# Altium project SensorBoard.PrjPcb
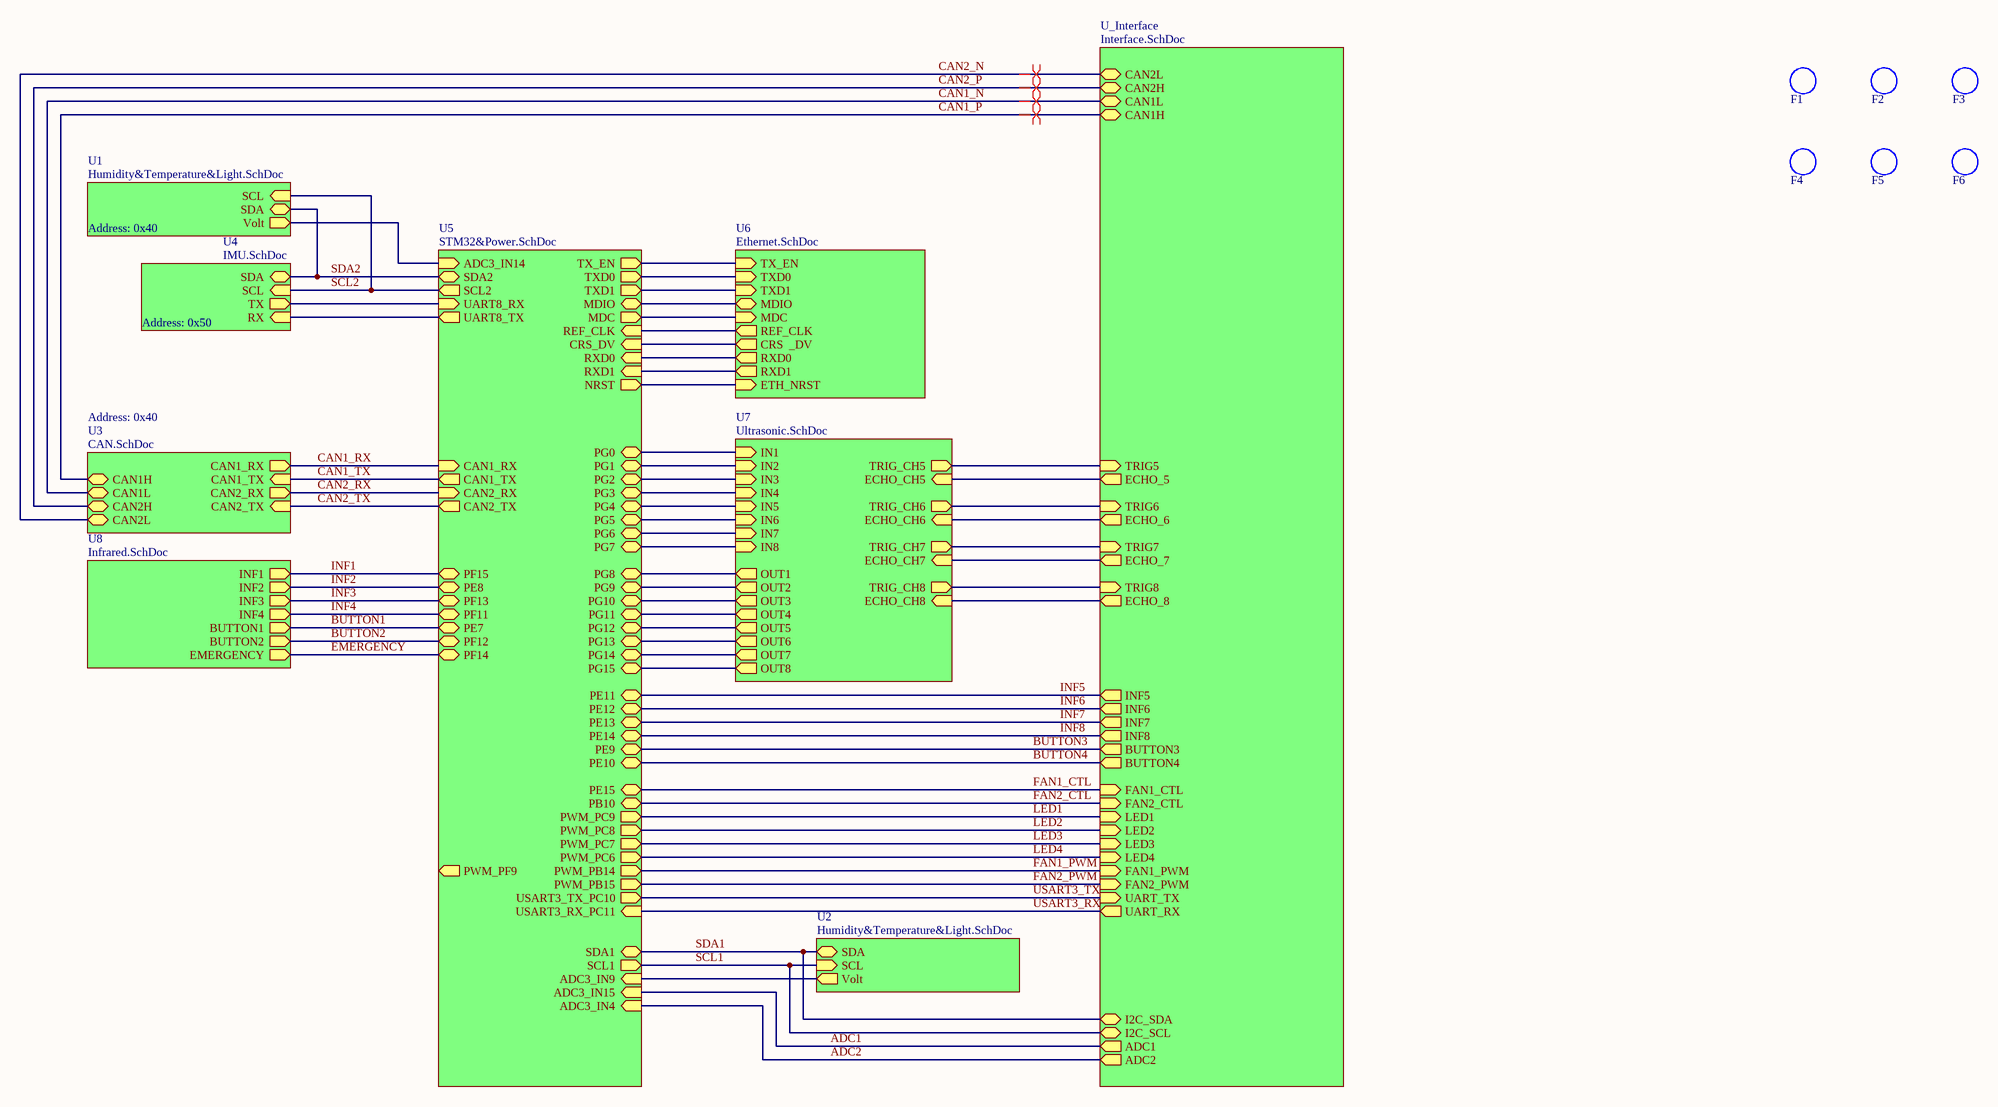
[diagram p0: SensorBoard.SchDoc]
9 sheets, 169 parts. Net scope: hierarchical (ports join the sheet entries above them; power ports are global).
Board file: Sensor.PcbDoc
Sheets:
  SensorBoard.SchDoc
    U6 = Ethernet.SchDoc
    U5 = STM32&Power.SchDoc
    U4 = IMU.SchDoc
    U1 = Humidity&Temperature&Light.SchDoc
    U2 = Humidity&Temperature&Light.SchDoc
    U3 = CAN.SchDoc
    U7 = Ultrasonic.SchDoc
    U8 = Infrared.SchDoc
    U_Interface = Interface.SchDoc

## Sheet SensorBoard.SchDoc
size A2

### Parts
F1  Fiducial, .040"  [FIDUCIAL, .040"]  (value not drawn)  (no BOM)
F2  Fiducial, .040"  [FIDUCIAL, .040"]  (value not drawn)  (no BOM)
F3  Fiducial, .040"  [FIDUCIAL, .040"]  (value not drawn)  (no BOM)
F4  Fiducial, .040"  [FIDUCIAL, .040"]  (value not drawn)  (no BOM)
F5  Fiducial, .040"  [FIDUCIAL, .040"]  (value not drawn)  (no BOM)
F6  Fiducial, .040"  [FIDUCIAL, .040"]  (value not drawn)  (no BOM)

### Sub-sheets
U1 = Humidity&Temperature&Light.SchDoc: SDA (bidir), SCL (in), Volt (out)
U2 = Humidity&Temperature&Light.SchDoc: SDA (bidir), SCL (in), Volt (out)
U3 = CAN.SchDoc: CAN1_TX (in), CAN1_RX (out), CAN2_TX (in), CAN2_RX (out), CAN1H (bidir), CAN2H (bidir), CAN1L (bidir), CAN2L (bidir)
U4 = IMU.SchDoc: RX (in), TX (out), SDA (bidir), SCL (in)
U5 = STM32&Power.SchDoc: SDA1 (bidir), SCL1 (out), MDC (out), REF_CLK (in), MDIO (bidir), CRS_DV (in), TX_EN (out), TXD0 (out), TXD1 (out), RXD0 (in), RXD1 (in), UART8_RX (in), UART8_TX (out), SDA2 (bidir), SCL2 (out), ADC3_IN14 (in), ADC3_IN15 (in), ADC3_IN9 (in), CAN2_TX (out), CAN2_RX (in), CAN1_TX (out), CAN1_RX (in), PG0 (bidir), PG1 (bidir), PG2 (bidir), PG3 (bidir), PG4 (bidir), PG5 (bidir), PG6 (bidir), PG7 (bidir), PG15 (bidir), PG10 (bidir), PG13 (bidir), PG9 (bidir), PG8 (bidir), PG12 (bidir), PG14 (bidir), PG11 (bidir), PF13 (bidir), PF12 (bidir), PF15 (bidir), PF14 (bidir), PF11 (bidir), PE14 (bidir), PE13 (bidir), PE10 (bidir), PE7 (bidir), PE15 (bidir), PE9 (bidir), PE12 (bidir), PE8 (bidir), PE11 (bidir), PB10 (bidir), PWM_PC6 (out), PWM_PF9 (out), PWM_PC9 (out), PWM_PC8 (out), PWM_PC7 (out), ADC3_IN4 (in), USART3_RX_PC11 (in), USART3_TX_PC10 (out), NRST (out), PWM_PB14 (out), PWM_PB15 (out)
U6 = Ethernet.SchDoc: TX_EN (in), RXD1 (out), TXD0 (in), TXD1 (in), RXD0 (out), CRS  _DV (out), MDIO (bidir), MDC (in), REF_CLK (out), ETH_NRST (in)
U7 = Ultrasonic.SchDoc: OUT1 (out), OUT2 (out), OUT3 (out), OUT4 (out), OUT5 (out), OUT6 (out), OUT7 (out), OUT8 (out), IN1 (in), IN2 (in), IN3 (in), IN4 (in), IN5 (in), IN6 (in), IN7 (in), IN8 (in), ECHO_CH5 (in), ECHO_CH6 (in), ECHO_CH7 (in), ECHO_CH8 (in), TRIG_CH5 (out), TRIG_CH6 (out), TRIG_CH7 (out), TRIG_CH8 (out)
U8 = Infrared.SchDoc: INF1 (out), INF2 (out), INF3 (out), INF4 (out), BUTTON1 (out), BUTTON2 (out), EMERGENCY (out)
U_Interface = Interface.SchDoc: CAN1H (bidir), CAN1L (bidir), CAN2H (bidir), CAN2L (bidir), ECHO_5 (out), ECHO_6 (out), ECHO_7 (out), ECHO_8 (out), TRIG5 (in), TRIG6 (in), TRIG7 (in), TRIG8 (in), BUTTON3 (out), BUTTON4 (out), INF5 (out), INF6 (out), INF7 (out), INF8 (out), I2C_SCL (bidir), I2C_SDA (bidir), LED1 (in), LED2 (in), LED3 (in), LED4 (in), ADC1 (out), ADC2 (out), UART_TX (in), UART_RX (out), FAN1_CTL (in), FAN2_CTL (in), FAN1_PWM (in), FAN2_PWM (in)

### Nets
ADC1: sheet U5/ADC3_IN15, sheet U_Interface/ADC1
ADC2: sheet U5/ADC3_IN4, sheet U_Interface/ADC2
BUTTON1: sheet U5/PE7, sheet U8/BUTTON1
BUTTON2: sheet U5/PF12, sheet U8/BUTTON2
BUTTON3: sheet U5/PE9, sheet U_Interface/BUTTON3
BUTTON4: sheet U5/PE10, sheet U_Interface/BUTTON4
CAN1_N: sheet U3/CAN1L, sheet U_Interface/CAN1L
CAN1_P: sheet U3/CAN1H, sheet U_Interface/CAN1H
CAN1_RX: sheet U5/CAN1_RX, sheet U3/CAN1_RX
CAN1_TX: sheet U5/CAN1_TX, sheet U3/CAN1_TX
CAN2_N: sheet U3/CAN2L, sheet U_Interface/CAN2L
CAN2_P: sheet U3/CAN2H, sheet U_Interface/CAN2H
CAN2_RX: sheet U5/CAN2_RX, sheet U3/CAN2_RX
CAN2_TX: sheet U5/CAN2_TX, sheet U3/CAN2_TX
CRS  _DV: sheet U6/CRS  _DV, sheet U5/CRS_DV
ECHO_CH5: sheet U7/ECHO_CH5, sheet U_Interface/ECHO_5
ECHO_CH6: sheet U7/ECHO_CH6, sheet U_Interface/ECHO_6
ECHO_CH7: sheet U7/ECHO_CH7, sheet U_Interface/ECHO_7
ECHO_CH8: sheet U7/ECHO_CH8, sheet U_Interface/ECHO_8
EMERGENCY: sheet U5/PF14, sheet U8/EMERGENCY
FAN1_CTL: sheet U5/PE15, sheet U_Interface/FAN1_CTL
FAN1_PWM: sheet U5/PWM_PB14, sheet U_Interface/FAN1_PWM
FAN2_CTL: sheet U5/PB10, sheet U_Interface/FAN2_CTL
FAN2_PWM: sheet U5/PWM_PB15, sheet U_Interface/FAN2_PWM
INF1: sheet U5/PF15, sheet U8/INF1
INF2: sheet U5/PE8, sheet U8/INF2
INF3: sheet U5/PF13, sheet U8/INF3
INF4: sheet U5/PF11, sheet U8/INF4
INF5: sheet U5/PE11, sheet U_Interface/INF5
INF6: sheet U5/PE12, sheet U_Interface/INF6
INF7: sheet U5/PE13, sheet U_Interface/INF7
INF8: sheet U5/PE14, sheet U_Interface/INF8
LED1: sheet U5/PWM_PC9, sheet U_Interface/LED1
LED2: sheet U5/PWM_PC8, sheet U_Interface/LED2
LED3: sheet U5/PWM_PC7, sheet U_Interface/LED3
LED4: sheet U5/PWM_PC6, sheet U_Interface/LED4
MDC: sheet U6/MDC, sheet U5/MDC
MDIO: sheet U6/MDIO, sheet U5/MDIO
NRST: sheet U6/ETH_NRST, sheet U5/NRST
PG0: sheet U5/PG0, sheet U7/IN1
PG1: sheet U5/PG1, sheet U7/IN2
PG2: sheet U5/PG2, sheet U7/IN3
PG3: sheet U5/PG3, sheet U7/IN4
PG4: sheet U5/PG4, sheet U7/IN5
PG5: sheet U5/PG5, sheet U7/IN6
PG6: sheet U5/PG6, sheet U7/IN7
PG7: sheet U5/PG7, sheet U7/IN8
PG8: sheet U5/PG8, sheet U7/OUT1
PG9: sheet U5/PG9, sheet U7/OUT2
PG10: sheet U5/PG10, sheet U7/OUT3
PG11: sheet U5/PG11, sheet U7/OUT4
PG12: sheet U5/PG12, sheet U7/OUT5
PG13: sheet U5/PG13, sheet U7/OUT6
PG14: sheet U5/PG14, sheet U7/OUT7
PG15: sheet U5/PG15, sheet U7/OUT8
REF_CLK: sheet U6/REF_CLK, sheet U5/REF_CLK
RXD0: sheet U6/RXD0, sheet U5/RXD0
RXD1: sheet U6/RXD1, sheet U5/RXD1
SCL1: sheet U5/SCL1, sheet U2/SCL, sheet U_Interface/I2C_SCL
SCL2: sheet U5/SCL2, sheet U4/SCL, sheet U1/SCL
SDA1: sheet U5/SDA1, sheet U2/SDA, sheet U_Interface/I2C_SDA
SDA2: sheet U5/SDA2, sheet U4/SDA, sheet U1/SDA
TRIG_CH5: sheet U7/TRIG_CH5, sheet U_Interface/TRIG5
TRIG_CH6: sheet U7/TRIG_CH6, sheet U_Interface/TRIG6
TRIG_CH7: sheet U7/TRIG_CH7, sheet U_Interface/TRIG7
TRIG_CH8: sheet U7/TRIG_CH8, sheet U_Interface/TRIG8
TX_EN: sheet U6/TX_EN, sheet U5/TX_EN
TXD0: sheet U6/TXD0, sheet U5/TXD0
TXD1: sheet U6/TXD1, sheet U5/TXD1
UART8_RX: sheet U5/UART8_RX, sheet U4/TX
UART8_TX: sheet U5/UART8_TX, sheet U4/RX
USART3_RX: sheet U5/USART3_RX_PC11, sheet U_Interface/UART_RX
USART3_TX: sheet U5/USART3_TX_PC10, sheet U_Interface/UART_TX
NetR19_U1_1: sheet U5/ADC3_IN14, sheet U1/Volt
NetR19_U2_1: sheet U5/ADC3_IN9, sheet U2/Volt

### Layout directives
differential pair: CAN1_N, CAN1_P, CAN2_N, CAN2_P

### Notes on the sheet
- Address: 0x40
- Address: 0x50

### Library data of the parts
F1-F6 = Fiducial, .040": Designator: F?; Part Number: Fiducial, .040"; Component Type: Standard (No BOM)

## Sheet Ethernet.SchDoc
size A2
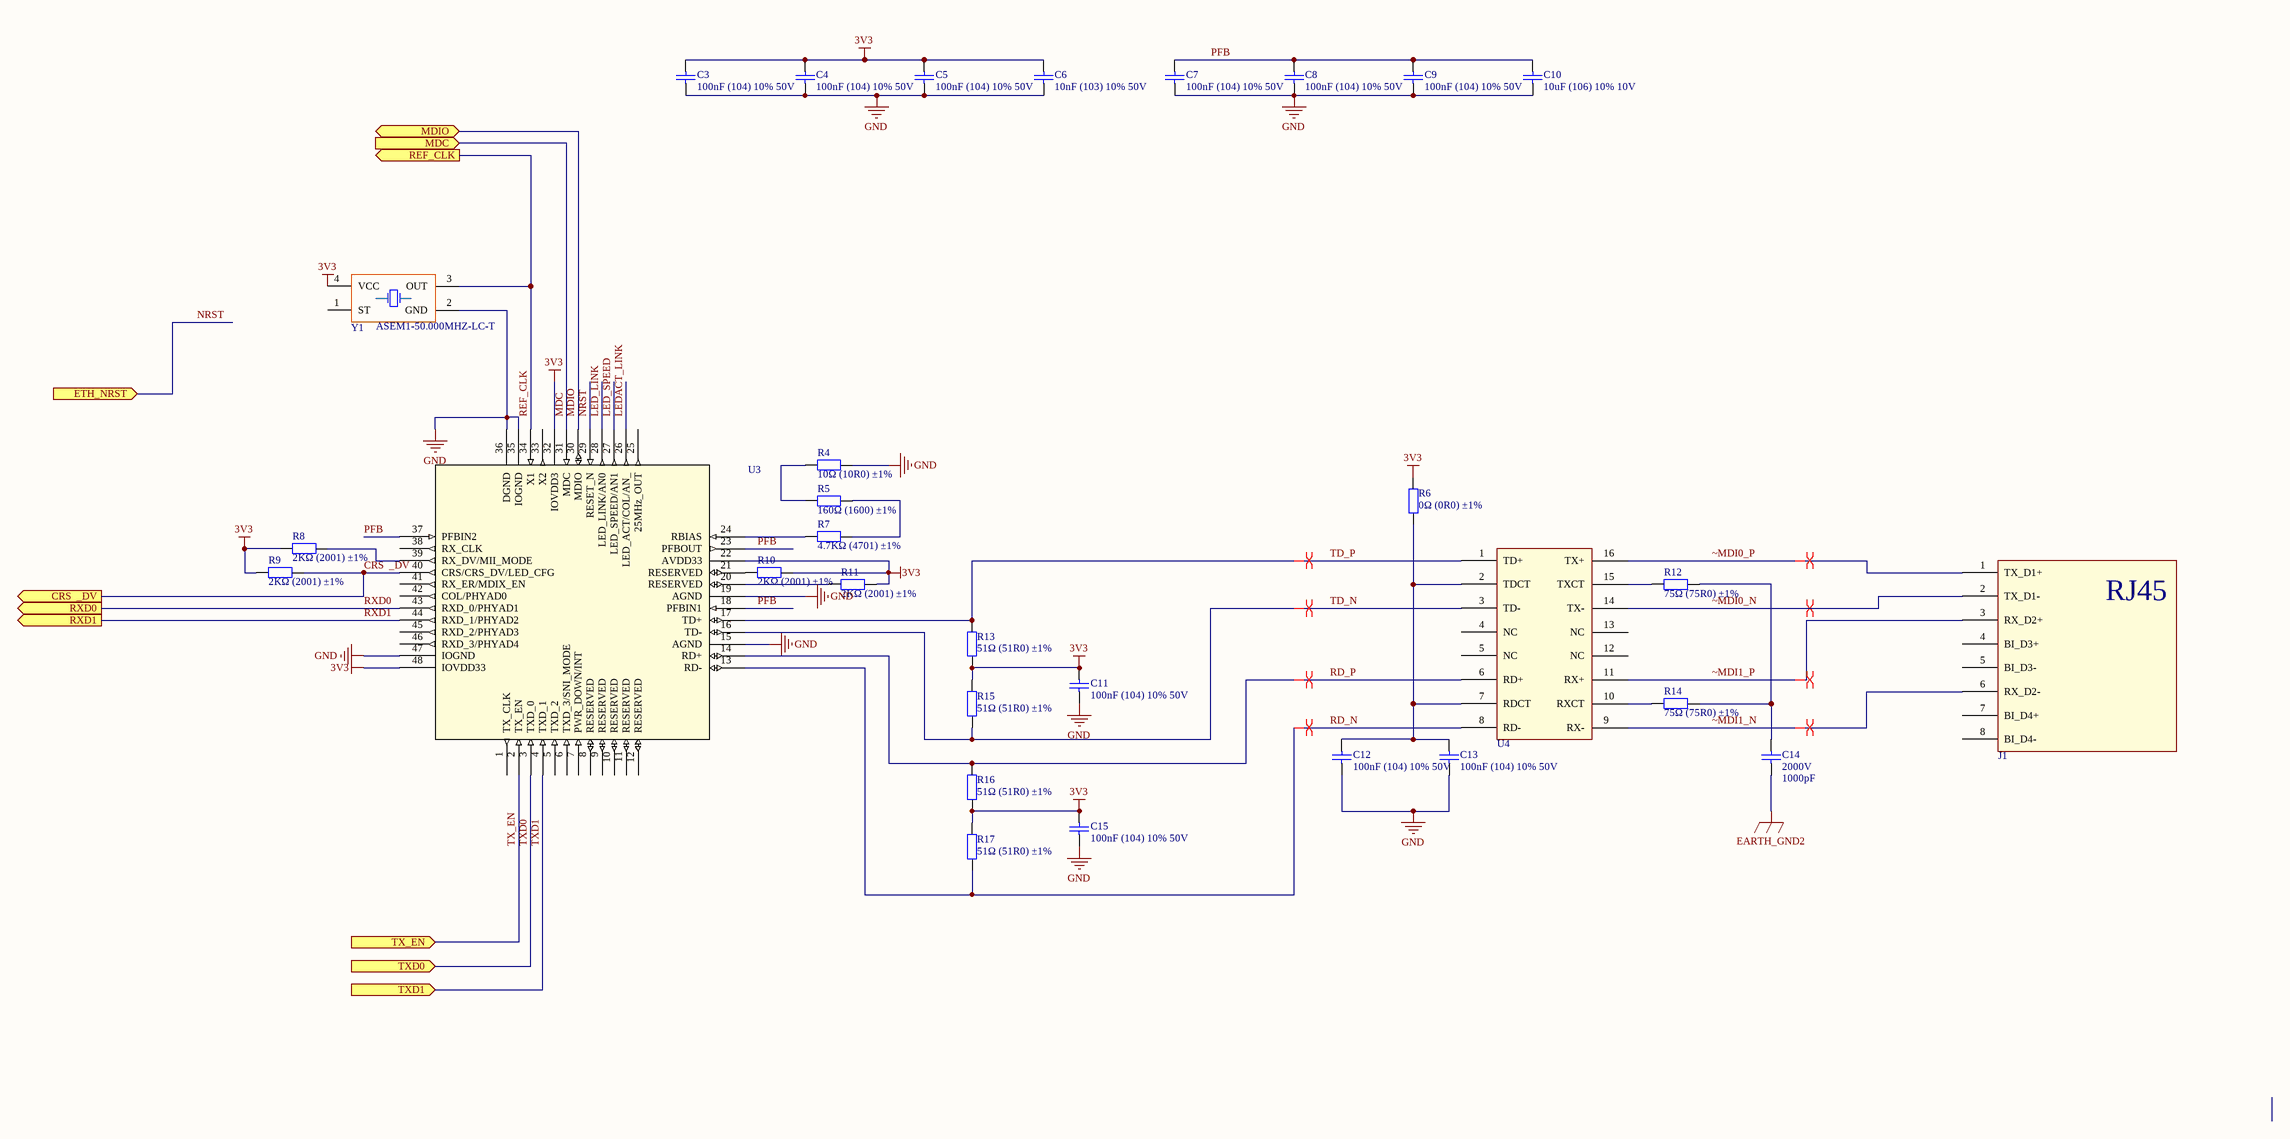
[diagram p1: Ethernet.SchDoc]

### Parts
C3  100nF (104) 10% 50V  [0603_C]
C4  100nF (104) 10% 50V  [0603_C]
C5  100nF (104) 10% 50V  [0603_C]
C6  10nF (103) 10% 50V  [0603_C]
C7  100nF (104) 10% 50V  [0603_C]
C8  100nF (104) 10% 50V  [0603_C]
C9  100nF (104) 10% 50V  [0603_C]
C10  10uF (106) 10% 10V  [0603_C]
C11  100nF (104) 10% 50V  [0603_C]
C12  100nF (104) 10% 50V  [0603_C]
C13  100nF (104) 10% 50V  [0603_C]
C14  2000V  value 1000pF  [CAP1210N]
C15  100nF (104) 10% 50V  [0603_C]
J1  Jack Modular Connector 8p8c (RJ45, Ethernet) Vertical Unshielded Cat3  [RJ45-5556416-1]  (value not drawn)
R4  10Ω (10R0) ±1%  [0603_R]
R5  160Ω (1600) ±1%  [0603_R]
R6  0Ω (0R0) ±1%  [0603_R]
R7  4.7KΩ (4701) ±1%  [0603_R]
R8  2KΩ (2001) ±1%  [0603_R]
R9  2KΩ (2001) ±1%  [0603_R]
R10  2KΩ (2001) ±1%  [0603_R]
R11  2KΩ (2001) ±1%  [0603_R]
R12  75Ω (75R0) ±1%  [0603_R]
R13  51Ω (51R0) ±1%  [0603_R]
R14  75Ω (75R0) ±1%  [0603_R]
R15  51Ω (51R0) ±1%  [0603_R]
R16  51Ω (51R0) ±1%  [0603_R]
R17  51Ω (51R0) ±1%  [0603_R]
U3  IC TXRX ETHERNET 48LQFP  [48-LQFP]  (value not drawn)
U4  TRANSFORMER  [Bel_transformer]  (value not drawn)
Y1  Part Number: ASEM1-50.000MHZ-LC-T  [SMD-3225]  (hidden comment: Oscillator)

### Ports
CRS  _DV (out), ETH_NRST (in), MDC (in), MDIO (bidir), REF_CLK (out), RXD0 (out), RXD1 (out), TX_EN (in), TXD0 (in), TXD1 (in)

### Nets
3V3: C3.2 C4.2 C5.2 C6.2 C11.2 C15.2 R6.2 R8.2 R9.2 R10.1 R11.1 R13.1 R15.2 R16.1 R17.2 U3.22(AVDD33) U3.32(IOVDD3) U3.48(IOVDD33) Y1.4(VCC)
EARTH_GND2: C14.1
GND: C3.1 C4.1 C5.1 C6.1 C7.1 C8.1 C9.1 C10.1 C11.1 C12.2 C13.1 C15.1 R4.2 U3.15(AGND) U3.19(AGND) U3.35(IOGND) U3.36(DGND) U3.47(IOGND) Y1.2(GND)
CRS  _DV: R9.1 U3.40(CRS/CRS_DV/LED_CFG) ; port CRS  _DV
LED_LINK: U3.28(LED_LINK/AN0)
LED_SPEED: U3.27(LED_SPEED/AN1)
LEDACT_LINK: U3.26(LED_ACT/COL/AN_)
MDC: U3.31(MDC) ; port MDC
MDIO: U3.30(MDIO) ; port MDIO
NRST: U3.29(RESET_N) ; port ETH_NRST
PFB: C7.2 C8.2 C9.2 C10.2 U3.18(PFBIN1) U3.23(PFBOUT) U3.37(PFBIN2)
RD_N: R17.1 U3.13(RD-) U4.8(RD-)
RD_P: R16.2 U3.14(RD+) U4.6(RD+)
REF_CLK: U3.34(X1) Y1.3(OUT) ; port REF_CLK
RXD0: U3.43(RXD_0/PHYAD1) ; port RXD0
RXD1: U3.44(RXD_1/PHYAD2) ; port RXD1
TD_N: R15.1 U3.16(TD-) U4.3(TD-)
TD_P: R13.2 U3.17(TD+) U4.1(TD+)
TX_EN: U3.2(TX_EN) ; port TX_EN
TXD0: U3.3(TXD_0) ; port TXD0
TXD1: U3.4(TXD_1) ; port TXD1
~MDI0_N: J1.2(TX_D1-) U4.14(TX-)
~MDI0_P: J1.1(TX_D1+) U4.16(TX+)
~MDI1_N: J1.6(RX_D2-) U4.9(RX-)
~MDI1_P: J1.3(RX_D2+) U4.11(RX+)
NetC12_1: C12.1 C13.2 R6.1 U4.2(TDCT) U4.7(RDCT)
NetC14_2: C14.2 R12.2 R14.2
NetR4_1: R4.1 R5.1
NetR5_2: R5.2 R7.2
NetR7_1: R7.1 U3.24(RBIAS)
NetR8_1: R8.1 U3.39(RX_DV/MII_MODE)
NetR10_2: R10.2 U3.21(RESERVED)
NetR11_2: R11.2 U3.20(RESERVED)
NetR12_1: R12.1 U4.15(TXCT)
NetR14_1: R14.1 U4.10(RXCT)

Not connected (* = marked no-connect by the designer): J1 4(BI_D3+) 5(BI_D3-) 7(BI_D4+) 8(BI_D4-); U3 1(TX_CLK) 5(TXD_2) 6(TXD_3/SNI_MODE) 7(PWR_DOWN/INT) 8(RESERVED) 9(RESERVED) 10(RESERVED) 11(RESERVED) 12(RESERVED) 25(25MHz_OUT) 33(X2) 38(RX_CLK) 41(RX_ER/MDIX_EN) 42(COL/PHYAD0) 45(RXD_2/PHYAD3) 46(RXD_3/PHYAD4); U4 4(NC) 5(NC) 12(NC) 13(NC); Y1 1(ST)

### Layout directives
differential pair: RD_N, RD_P, TD_N, TD_P, ~MDI0_N, ~MDI0_P, ~MDI1_N, ~MDI1_P

### Notes on the sheet
- (in symbol 5556416-1) RJ45

### Library data of the parts
C3-C5 C7-C9 C11-C13 C15 = 0603 100nF (104) 10% 50V: 贴片电容; ComponentLink1Description: 供应商链接; ComponentLink1URL: http://www.szlcsc.com/product/details_15331.html; Package: 0603; Supplier: LC; SuppliersPartNumber: C14663
C6 = 0603 10nF (103) 10% 50V: 贴片电容; ComponentLink1Description: 供应商链接; ComponentLink1URL: http://www.szlcsc.com/product/details_58143.html; Package: 0603; Supplier: LC; SuppliersPartNumber: C57112
C10 = 0603 10uF (106) 10% 10V: 贴片电容; ComponentLink1Description: 供应商链接; ComponentLink1URL: http://www.szlcsc.com/product/details_20411.html; Package: 0603; Supplier: LC; SuppliersPartNumber: C19702
C14 = CAP 1000pF ±10% 2000V (2kV) Ceramic Capacitor X7R 1210 (3225 Metric): Manufacturer: Samsung Electro-Mechanics; Manufacturer Part Number: CL32B102KJFNNNE; Unit Price in Quantity: 0.0884; Part Number: CAP 1000pF ±10% 2000V (2kV) Ceramic Capacitor X7R 1210 (3225 Metric); Component Type: Standard; Mounting Type: smt; Supplier 1: Digikey; Supplier 1 Part Number: 1276-3316-6-ND; Part URL-Supplier 1: https://www.digikey.com/product-detail/en/samsung-electro-mechanics/CL32B102KJFNNNE/1276-3316-6-ND/3893831; Unit Price-Supplier 1: 0.34; Price Break: 1000; Vendor/Distributor: Digikey; Package: 1210
J1 = 5556416-1: RJ45 connector 180 degrees; Manufacturer: TE; Unit Price in Quantity: .5722; Part Number: 5556416-1; Mounting Type: thru-hole; Package: Header; Component Type: Standard; Pin Count: 8; Manufacturer Part Number: 5556416-1; Supplier 1: Digikey; Supplier 1 Part Number: A31428-ND; Unit Price-Supplier 1: 1.04; Price Break: 1000; Vendor/Distributor: Digikey
R4 = 0603 10Ω (10R0) 1%: 贴片电阻; ComponentLink1Description: 供应商链接; ComponentLink1URL: http://www.szlcsc.com/product/details_23586.html; Package: 0603; Supplier: LC; SuppliersPartNumber: C22859
R5 = 0603 160Ω (1600) 1%: 贴片电阻; ComponentLink1Description: 供应商链接; ComponentLink1URL: http://www.szlcsc.com/product/details_23541.html; Package: 0603; Supplier: LC; SuppliersPartNumber: C22814
R6 = 0603 0Ω (0R0) 1%: 贴片电阻; ComponentLink1Description: 供应商链接; ComponentLink1URL: http://www.szlcsc.com/product/details_21903.html; Package: 0603; Supplier: LC; SuppliersPartNumber: C21189
R7 = 0603 4.7KΩ (4701) 1%: 贴片电阻; ComponentLink1Description: 供应商链接; ComponentLink1URL: http://www.szlcsc.com/product/details_23889.html; Package: 0603; Supplier: LC; SuppliersPartNumber: C23162
R8-R11 = 0603 2KΩ (2001) 1%: 贴片电阻; ComponentLink1Description: 供应商链接; ComponentLink1URL: http://www.szlcsc.com/product/details_23702.html; Package: 0603; Supplier: LC; SuppliersPartNumber: C22975
R12 R14 = 0603 75Ω (75R0) 1%: 贴片电阻; ComponentLink1Description: 供应商链接; ComponentLink1URL: http://www.szlcsc.com/product/details_4682.html; Package: 0603; Supplier: LC; SuppliersPartNumber: C4275
R13 R15-R17 = 0603 51Ω (51R0) 1%: 贴片电阻; ComponentLink1Description: 供应商链接; ComponentLink1URL: http://www.szlcsc.com/product/details_23924.html; Package: 0603; Supplier: LC; SuppliersPartNumber: C23197
U3 = DP83848CVVX/NOPB: Manufacturer: Texas Instruments; Unit Price in Quantity: 3.2349; Part Number: DP83848CVVX/NOPB; Component Type: Standard; Pin Count: 48; Manufacturer Part Number: DP83848CVVX/NOPB; Mounting Type: fine pitch; Package: 48-LQFP; Supplier 1: Digikey; Supplier 1 Part Number: DP83848CVVX/NOPBCT-ND; Unit Price-Supplier 1: 5.16; Price Break: 500
U4 = MODULE XFRMR LAN 10/100B-TX SMD: Manufacturer: Bel Fuse Inc.; Manufacturer Part Number: S558-5999-U7-F; Unit Price in Quantity: 1.9439; Part Number: MODULE XFRMR LAN 10/100B-TX SMD; Mounting Type: smt; Package: Non-standard; Component Type: Standard; DatasheetDocument: https://www.belfuse.com/resources/ICMs/lan-/S558-5999-U7-F.pdf; Supplier 1: Digikey; Supplier 1 Part Number: 507-1463-1-ND; Part URL-Supplier 1: https://www.digikey.sg/product-detail/zh/bel-fuse-inc/S558-5999-U7-F/507-1463-1-ND/2108047; Unit Price-Supplier 1: 3.6; Price Break: 900; Vendor/Distributor: Digikey
Y1 = ASEM1-50.000MHZ-LC-T: OSC MEMS 50.000MHZ CMOS SMD; Manufacturer: Abracon LLC; Unit Price in Quantity: .8712; Mounting Type: smt; Package: SMD3225; Component Type: Standard; Manufacturer Part Number: ASEM1-50.000MHZ-LC-T; Supplier 1: Digikey; Supplier 1 Part Number: 535-9774-1-ND; Unit Price-Supplier 1: 1.26; Price Break: 500; Vendor/Distributor: Digikey

## Sheet STM32&Power.SchDoc
size A2
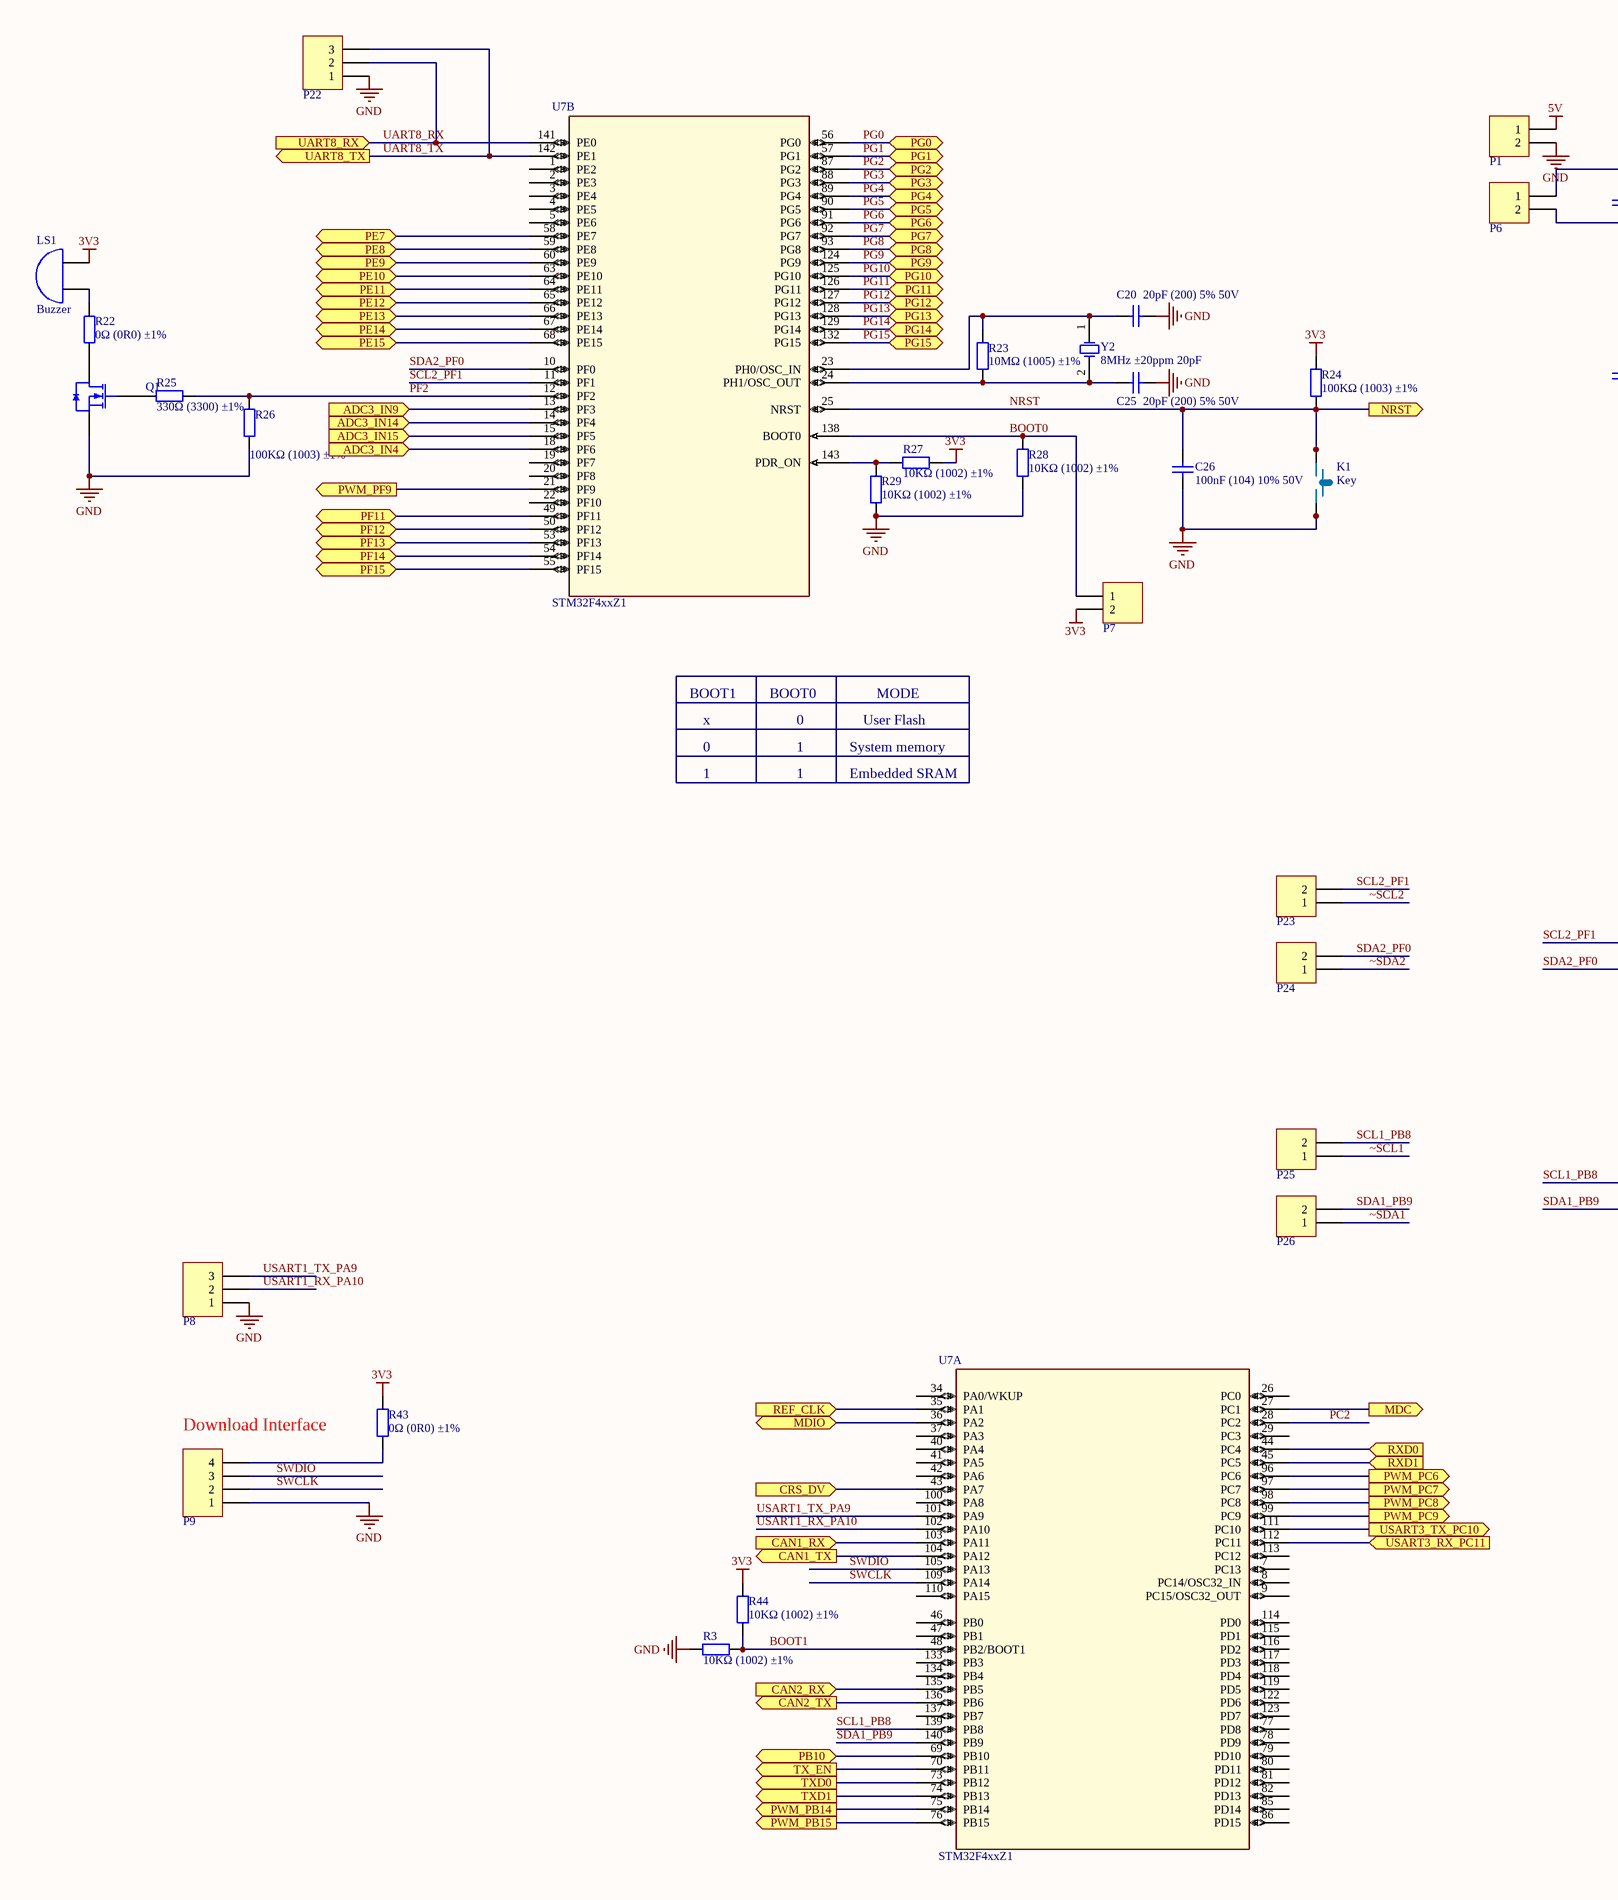
[diagram p2: STM32&Power.SchDoc, left]
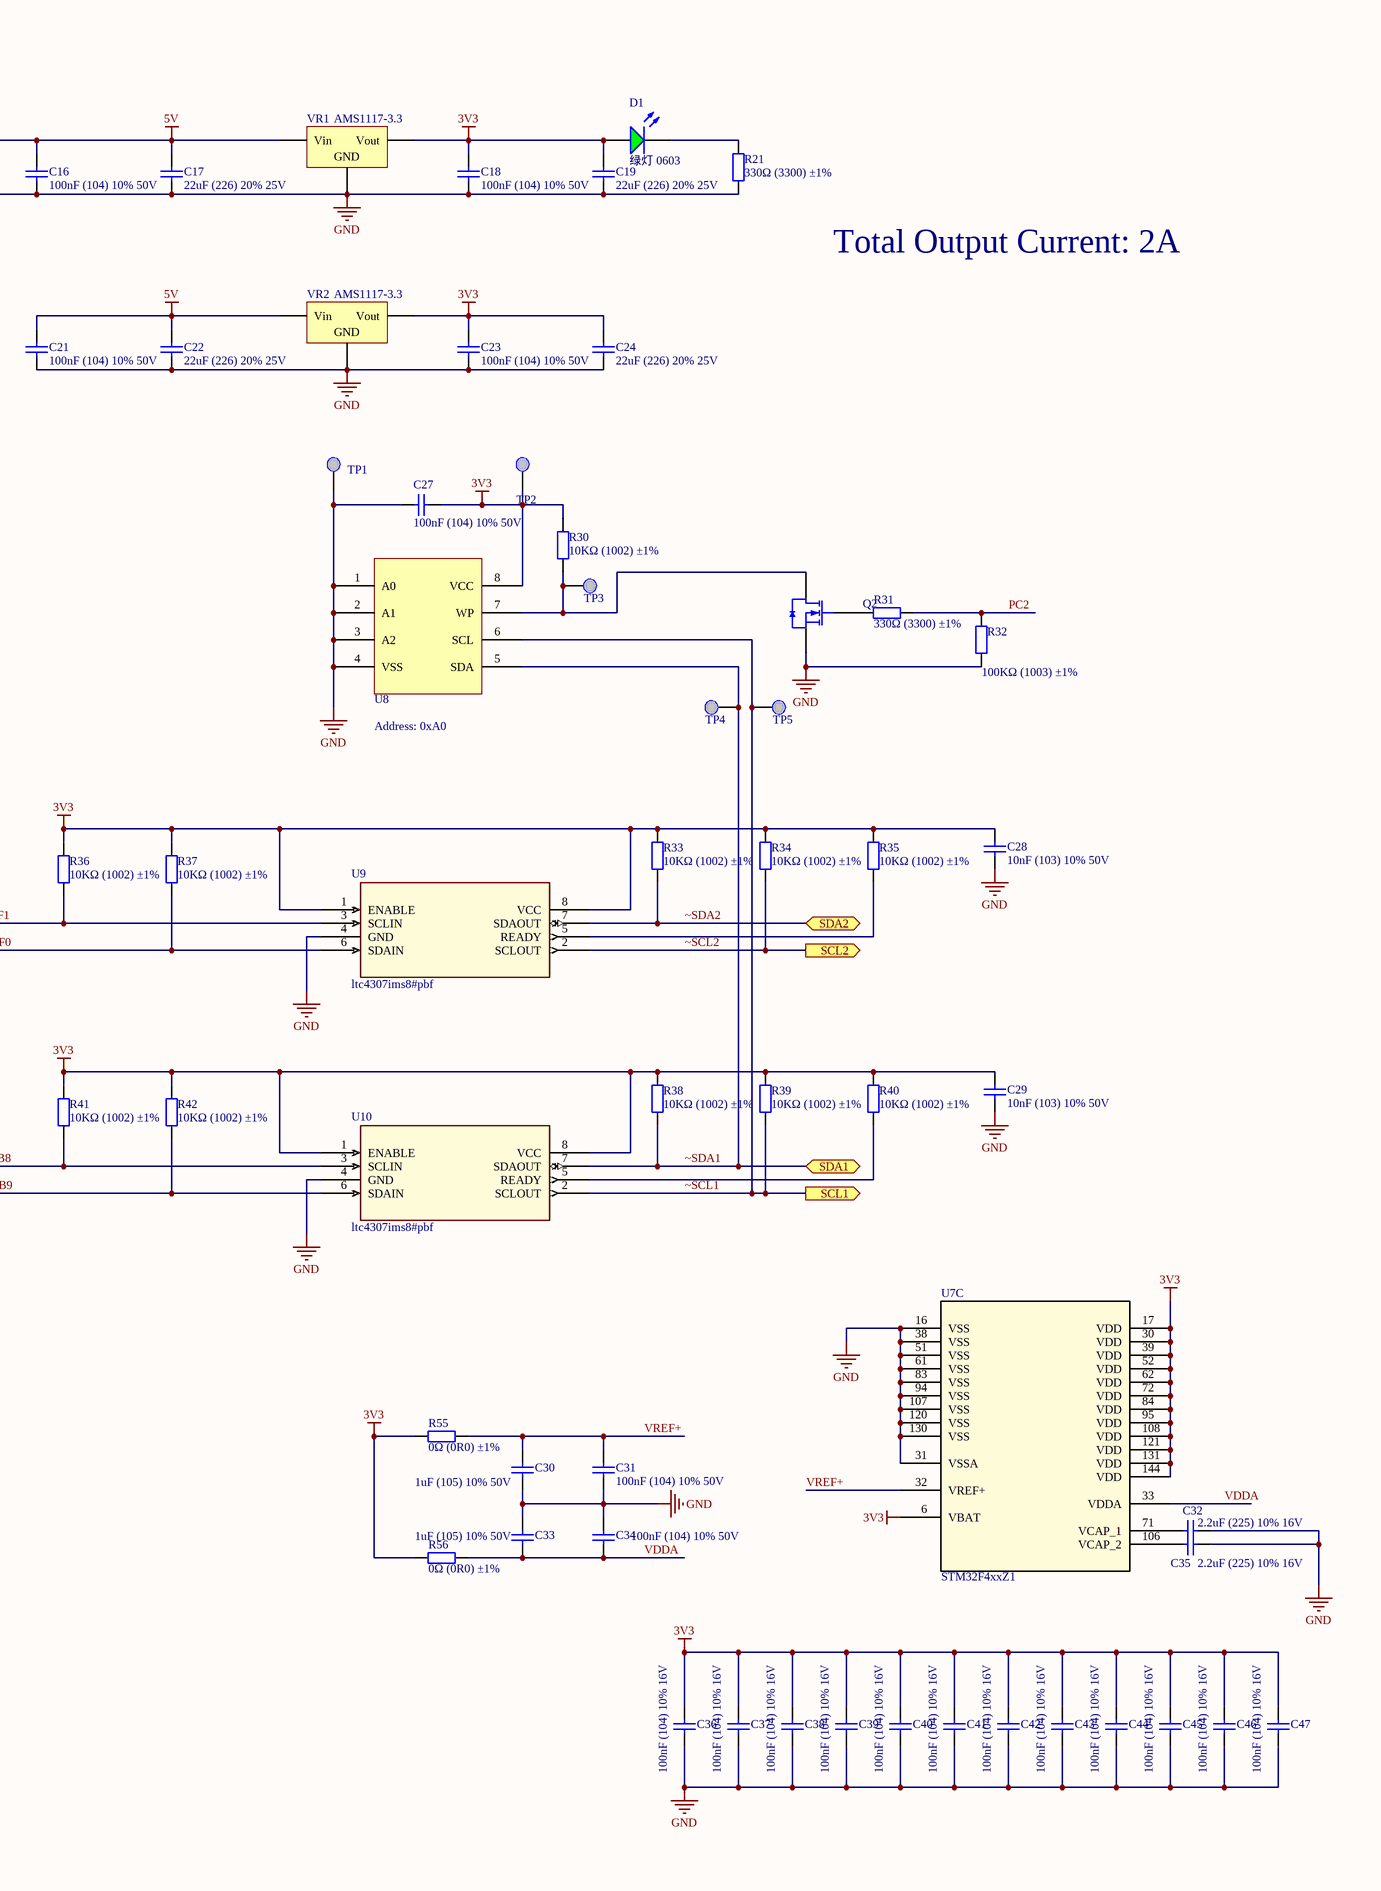
[diagram p3: STM32&Power.SchDoc, right]

### Parts
C16  100nF (104) 10% 50V  [0603_C]
C17  22uF (226) 20% 25V  [0805_C]
C18  100nF (104) 10% 50V  [0603_C]
C19  22uF (226) 20% 25V  [0805_C]
C20  20pF (200) 5% 50V  [0603_C]
C21  100nF (104) 10% 50V  [0603_C]
C22  22uF (226) 20% 25V  [0805_C]
C23  100nF (104) 10% 50V  [0603_C]
C24  22uF (226) 20% 25V  [0805_C]
C25  20pF (200) 5% 50V  [0603_C]
C26  100nF (104) 10% 50V  [0603_C]
C27  100nF (104) 10% 50V  [0603_C]
C28  10nF (103) 10% 50V  [0603_C]
C29  10nF (103) 10% 50V  [0603_C]
C30  1uF (105) 10% 50V  [0603_C]
C31  100nF (104) 10% 50V  [0603_C]
C32  2.2uF (225) 10% 16V  [0603_C]
C33  1uF (105) 10% 50V  [0603_C]
C34  100nF (104) 10% 50V  [0603_C]
C35  2.2uF (225) 10% 16V  [0603_C]
C36  100nF (104) 10% 16V  [0402_C]
C37  100nF (104) 10% 16V  [0402_C]
C38  100nF (104) 10% 16V  [0402_C]
C39  100nF (104) 10% 16V  [0402_C]
C40  100nF (104) 10% 16V  [0402_C]
C41  100nF (104) 10% 16V  [0402_C]
C42  100nF (104) 10% 16V  [0402_C]
C43  100nF (104) 10% 16V  [0402_C]
C44  100nF (104) 10% 16V  [0402_C]
C45  100nF (104) 10% 16V  [0402_C]
C46  100nF (104) 10% 16V  [0402_C]
C47  100nF (104) 10% 16V  [0402_C]
D1  绿灯 0603  [0603_LED_S1]
K1  Key  [Key]
LS1  Buzzer  [buzzer]
P1  0.1" 2POS Header SNGL  [2 POS HEADER SINGLE ROW]  (value not drawn)
P6  B2B-PH-SM4-TB(LF)(SN)  [B2B-PH-SM4-TB(LF)(SN)]  (value not drawn)
P7  0.1" 2POS Header SNGL  [2 POS HEADER SINGLE ROW]  (value not drawn)
P8  0.1" 3POS Header SNGL  [3 POS HEADER SINGLE ROW]  (value not drawn)
P9  0.1" 4POS Header SNGL  [4 POS HEADER SINGLE ROW]  (value not drawn)
P22  0.1" 3POS Header SNGL  [3 POS HEADER SINGLE ROW]  (value not drawn)
P23  0.1" 2POS Header SNGL  [2 POS HEADER SINGLE ROW]  (value not drawn)
P24  0.1" 2POS Header SNGL  [2 POS HEADER SINGLE ROW]  (value not drawn)
P25  0.1" 2POS Header SNGL  [2 POS HEADER SINGLE ROW]  (value not drawn)
P26  0.1" 2POS Header SNGL  [2 POS HEADER SINGLE ROW]  (value not drawn)
Q1  AO3400A N道沟 X0YV1T SOT-23  [SOT-23-3L]  (value not drawn)
Q2  AO3400A N道沟 X0YV1T SOT-23  [SOT-23-3L]  (value not drawn)
R3  10KΩ (1002) ±1%  [0603_R]
R21  330Ω (3300) ±1%  [0603_R]
R22  0Ω (0R0) ±1%  [0603_R]
R23  10MΩ (1005) ±1%  [0603_R]
R24  100KΩ (1003) ±1%  [0603_R]
R25  330Ω (3300) ±1%  [0603_R]
R26  100KΩ (1003) ±1%  [0603_R]
R27  10KΩ (1002) ±1%  [0603_R]
R28  10KΩ (1002) ±1%  [0603_R]
R29  10KΩ (1002) ±1%  [0603_R]
R30  10KΩ (1002) ±1%  [0603_R]
R31  330Ω (3300) ±1%  [0603_R]
R32  100KΩ (1003) ±1%  [0603_R]
R33  10KΩ (1002) ±1%  [0603_R]
R34  10KΩ (1002) ±1%  [0603_R]
R35  10KΩ (1002) ±1%  [0603_R]
R36  10KΩ (1002) ±1%  [0603_R]
R37  10KΩ (1002) ±1%  [0603_R]
R38  10KΩ (1002) ±1%  [0603_R]
R39  10KΩ (1002) ±1%  [0603_R]
R40  10KΩ (1002) ±1%  [0603_R]
R41  10KΩ (1002) ±1%  [0603_R]
R42  10KΩ (1002) ±1%  [0603_R]
R43  0Ω (0R0) ±1%  [0603_R]
R44  10KΩ (1002) ±1%  [0603_R]
R55  0Ω (0R0) ±1%  [0603_R]
R56  0Ω (0R0) ±1%  [0603_R]
TP1  Test Point, 60mil  [test_point_60_mil]  (value not drawn)
TP2  Test Point, 60mil  [test_point_60_mil]  (value not drawn)
TP3  Test Point, 60mil  [test_point_60_mil]  (value not drawn)
TP4  Test Point, 60mil  [test_point_60_mil]  (value not drawn)
TP5  Test Point, 60mil  [test_point_60_mil]  (value not drawn)
U7  STM32F4xxZ1  [LQFP-144_20x20x05P]  (parts A,B,C of 3)
U8  M24C02-WMN6TP  [SOIC127P600-8CM]  (value not drawn)
U9  ltc4307ims8#pbf  [MSOP-8_MS]
U10  ltc4307ims8#pbf  [MSOP-8_MS]
VR1  AMS1117-3.3  [SOT-223]
VR2  AMS1117-3.3  [SOT-223]
Y2  8MHz ±20ppm 20pF  [SMD-5032_2P]

### Ports
ADC3_IN4 (in), ADC3_IN9 (in), ADC3_IN14 (in), ADC3_IN15 (in), CAN1_RX (in), CAN1_TX (out), CAN2_RX (in), CAN2_TX (out), CRS_DV (in), MDC (out), MDIO (bidir), NRST (out), PB10 (bidir), PE7 (bidir), PE8 (bidir), PE9 (bidir), PE10 (bidir), PE11 (bidir), PE12 (bidir), PE13 (bidir), PE14 (bidir), PE15 (bidir), PF11 (bidir), PF12 (bidir), PF13 (bidir), PF14 (bidir), PF15 (bidir), PG0 (bidir), PG1 (bidir), PG2 (bidir), PG3 (bidir), PG4 (bidir), PG5 (bidir), PG6 (bidir), PG7 (bidir), PG8 (bidir), PG9 (bidir), PG10 (bidir), PG11 (bidir), PG12 (bidir), PG13 (bidir), PG14 (bidir), PG15 (bidir), PWM_PB14 (out), PWM_PB15 (out), PWM_PC6 (out), PWM_PC7 (out), PWM_PC8 (out), PWM_PC9 (out), PWM_PF9 (out), REF_CLK (in), RXD0 (in), RXD1 (in), SCL1 (out), SCL2 (out), SDA1 (bidir), SDA2 (bidir), TX_EN (out), TXD0 (out), TXD1 (out), UART8_RX (in), UART8_TX (out), USART3_RX_PC11 (in), USART3_TX_PC10 (out)

### Nets
3V3: C18.2 C19.2 C23.2 C24.2 C27.1 C28.2 C29.2 C36.2 C37.2 C38.2 C39.2 C40.2 C41.2 C42.2 C43.2 C44.2 C45.2 C46.2 C47.2 D1.A LS1.1(A) P7.2 R24.2 R27.2 R30.2 R33.2 R34.2 R35.2 R36.2 R37.2 R38.2 R39.2 R40.2 R41.2 R42.2 R43.2 R44.2 R55.1 R56.1 TP2.0 U7.6(VBAT) U7.17(VDD) U7.30(VDD) U7.39(VDD) U7.52(VDD) U7.62(VDD) U7.72(VDD) U7.84(VDD) U7.95(VDD) U7.108(VDD) U7.121(VDD) U7.131(VDD) U7.144(VDD) U8.8(VCC) U9.1(ENABLE) U9.8(VCC) U10.1(ENABLE) U10.8(VCC) VR1.2(Vout) VR2.2(Vout)
5V: C16.2 C17.2 C21.2 C22.2 P1.1 P6.1 VR1.3(Vin) VR2.3(Vin)
GND: C16.1 C17.1 C18.1 C19.1 C20.2 C21.1 C22.1 C23.1 C24.1 C25.2 C26.1 C27.2 C28.1 C29.1 C30.2 C31.1 C32.2 C33.1 C34.2 C35.2 C36.1 C37.1 C38.1 C39.1 C40.1 C41.1 C42.1 C43.1 C44.1 C45.1 C46.1 C47.1 K1.3 K1.4 P1.2 P6.2 P8.1 P9.1 P22.1 Q1.2(S) Q2.2(S) R3.2 R21.1 R26.1 R28.1 R29.1 R32.1 TP1.0 U7.16(VSS) U7.31(VSSA) U7.38(VSS) U7.51(VSS) U7.61(VSS) U7.83(VSS) U7.94(VSS) U7.107(VSS) U7.120(VSS) U7.130(VSS) U8.1(A0) U8.2(A1) U8.3(A2) U8.4(VSS) U9.4(GND) U10.4(GND) VR1.1(GND) VR2.1(GND)
ADC1: U7.15(PF5) ; port ADC3_IN15
ADC2: U7.18(PF6) ; port ADC3_IN4
BOOT0: P7.1 R28.2 U7.138(BOOT0)
BOOT1: R3.1 R44.1 U7.48(PB2/BOOT1)
BUTTON1: U7.58(PE7) ; port PE7
BUTTON2: U7.50(PF12) ; port PF12
BUTTON3: U7.60(PE9) ; port PE9
BUTTON4: U7.63(PE10) ; port PE10
CAN1_RX: U7.103(PA11) ; port CAN1_RX
CAN1_TX: U7.104(PA12) ; port CAN1_TX
CAN2_RX: U7.135(PB5) ; port CAN2_RX
CAN2_TX: U7.136(PB6) ; port CAN2_TX
CRS  _DV: U7.43(PA7) ; port CRS_DV
EMERGENCY: U7.54(PF14) ; port PF14
FAN1_CTL: U7.68(PE15) ; port PE15
FAN1_PWM: U7.75(PB14) ; port PWM_PB14
FAN2_CTL: U7.69(PB10) ; port PB10
FAN2_PWM: U7.76(PB15) ; port PWM_PB15
INF1: U7.55(PF15) ; port PF15
INF2: U7.59(PE8) ; port PE8
INF3: U7.53(PF13) ; port PF13
INF4: U7.49(PF11) ; port PF11
INF5: U7.64(PE11) ; port PE11
INF6: U7.65(PE12) ; port PE12
INF7: U7.66(PE13) ; port PE13
INF8: U7.67(PE14) ; port PE14
LED1: U7.99(PC9) ; port PWM_PC9
LED2: U7.98(PC8) ; port PWM_PC8
LED3: U7.97(PC7) ; port PWM_PC7
LED4: U7.96(PC6) ; port PWM_PC6
MDC: U7.27(PC1) ; port MDC
MDIO: U7.36(PA2) ; port MDIO
NRST: C26.2 K1.1 K1.2 R24.1 U7.25(NRST) ; port NRST
PC2: R31.2 R32.2 U7.28(PC2)
PF2: R25.2 R26.2 U7.12(PF2)
PG0: U7.56(PG0) ; port PG0
PG1: U7.57(PG1) ; port PG1
PG2: U7.87(PG2) ; port PG2
PG3: U7.88(PG3) ; port PG3
PG4: U7.89(PG4) ; port PG4
PG5: U7.90(PG5) ; port PG5
PG6: U7.91(PG6) ; port PG6
PG7: U7.92(PG7) ; port PG7
PG8: U7.93(PG8) ; port PG8
PG9: U7.124(PG9) ; port PG9
PG10: U7.125(PG10) ; port PG10
PG11: U7.126(PG11) ; port PG11
PG12: U7.127(PG12) ; port PG12
PG13: U7.128(PG13) ; port PG13
PG14: U7.129(PG14) ; port PG14
PG15: U7.132(PG15) ; port PG15
REF_CLK: U7.35(PA1) ; port REF_CLK
RXD0: U7.44(PC4) ; port RXD0
RXD1: U7.45(PC5) ; port RXD1
SCL1_PB8: P25.2 R41.1 U7.139(PB8) U10.3(SCLIN)
SCL2_PF1: P23.2 R36.1 U7.11(PF1) U9.3(SCLIN)
SDA1_PB9: P26.2 R42.1 U7.140(PB9) U10.6(SDAIN)
SDA2_PF0: P24.2 R37.1 U7.10(PF0) U9.6(SDAIN)
SWCLK: P9.2 U7.109(PA14)
SWDIO: P9.3 U7.105(PA13)
TX_EN: U7.70(PB11) ; port TX_EN
TXD0: U7.73(PB12) ; port TXD0
TXD1: U7.74(PB13) ; port TXD1
UART8_RX: P22.2 U7.141(PE0) ; port UART8_RX
UART8_TX: P22.3 U7.142(PE1) ; port UART8_TX
USART1_RX_PA10: P8.2 U7.102(PA10)
USART1_TX_PA9: P8.3 U7.101(PA9)
USART3_RX: U7.112(PC11) ; port USART3_RX_PC11
USART3_TX: U7.111(PC10) ; port USART3_TX_PC10
VDDA: C33.2 C34.1 R56.2 U7.33(VDDA)
VREF+: C30.1 C31.2 R55.2 U7.32(VREF+)
~SCL1: P25.1 R39.1 TP5.0 U8.6(SCL) U10.2(SCLOUT) ; port SCL1  [project net SCL1]
~SCL2: P23.1 R34.1 U9.2(SCLOUT) ; port SCL2  [project net SCL2]
~SDA1: P26.1 R38.1 TP4.0 U8.5(SDA) U10.7(SDAOUT) ; port SDA1  [project net SDA1]
~SDA2: P24.1 R33.1 U9.7(SDAOUT) ; port SDA2  [project net SDA2]
NetC20_1: C20.1 R23.2 U7.23(PH0/OSC_IN) Y2.1(OSC1)
NetC25_1: C25.1 R23.1 U7.24(PH1/OSC_OUT) Y2.2(OSC2)
NetC32_1: C32.1 U7.71(VCAP_1)
NetC35_1: C35.1 U7.106(VCAP_2)
NetD1_K: D1.K R21.2
NetLS1_2: LS1.2(B) R22.2
NetP9_4: P9.4 R43.1
NetQ1_1: Q1.1(G) R25.1
NetQ1_3: Q1.3(D) R22.1
NetQ2_1: Q2.1(G) R31.1
NetQ2_3: Q2.3(D) R30.1 TP3.0 U8.7(WP)
NetR19_U1_1: U7.14(PF4) ; port ADC3_IN14
NetR19_U2_1: U7.13(PF3) ; port ADC3_IN9
NetR27_1: R27.1 R29.2 U7.143(PDR_ON)
NetR35_1: R35.1 U9.5(READY)
NetR40_1: R40.1 U10.5(READY)
NetU7_21: U7.21(PF9) ; port PWM_PF9

Not connected (* = marked no-connect by the designer): U7 1(PE2) 2(PE3) 3(PE4) 4(PE5) 5(PE6) 7(PC13) 8(PC14/OSC32_IN) 9(PC15/OSC32_OUT) 19(PF7) 20(PF8) 22(PF10) 26(PC0) 29(PC3) 34(PA0/WKUP) 37(PA3) 40(PA4) 41(PA5) 42(PA6) 46(PB0) 47(PB1) 77(PD8) 78(PD9) 79(PD10) 80(PD11) 81(PD12) 82(PD13) 85(PD14) 86(PD15) 100(PA8) 110(PA15) 113(PC12) 114(PD0) 115(PD1) 116(PD2) 117(PD3) 118(PD4) 119(PD5) 122(PD6) 123(PD7) 133(PB3) 134(PB4) 137(PB7)

### Notes on the sheet
- Total Output Current: 2A
- BOOT1
- x
- BOOT0
- 0
- User Flash
- MODE
- 1
- System memory
- Embedded SRAM
- Address: 0xA0
- Download Interface

### Library data of the parts
C16 C18 C21 C23 C26 C27 C31 C34 = 0603 100nF (104) 10% 50V: 贴片电容; ComponentLink1Description: 供应商链接; ComponentLink1URL: http://www.szlcsc.com/product/details_15331.html; Package: 0603; Supplier: LC; SuppliersPartNumber: C14663
C17 C19 C22 C24 = 0805 22uF (226) 20% 25V: 贴片电容; ComponentLink1Description: 供应商链接; ComponentLink1URL: http://www.szlcsc.com/product/details_46786.html; Package: 0805; Supplier: LC; SuppliersPartNumber: C45783
C20 C25 = 0603 20pF (200) 5% 50V: 贴片电容; ComponentLink1Description: 供应商链接; ComponentLink1URL: http://www.szlcsc.com/product/details_2000.html; Package: 0603; Supplier: LC; SuppliersPartNumber: C1648
C28 C29 = 0603 10nF (103) 10% 50V: 贴片电容; ComponentLink1Description: 供应商链接; ComponentLink1URL: http://www.szlcsc.com/product/details_58143.html; Package: 0603; Supplier: LC; SuppliersPartNumber: C57112
C30 C33 = 0603 1uF (105) 10% 50V: 贴片电容; ComponentLink1Description: 供应商链接; ComponentLink1URL: http://www.szlcsc.com/product/details_16531.html; Package: 0603; Supplier: LC; SuppliersPartNumber: C15849
C32 C35 = 0603 2.2uF (225) 10% 16V: 贴片电容; ComponentLink1Description: 供应商链接; ComponentLink1URL: http://www.szlcsc.com/product/details_24366.html; Package: 0603; Supplier: LC; SuppliersPartNumber: C23630
C36-C47 = 0402 100nF (104) 10% 16V: 贴片电容; ComponentLink1Description: 供应商链接; ComponentLink1URL: http://www.szlcsc.com/product/details_1877.html; Package: 0402; Supplier: LC; SuppliersPartNumber: C1525
D1 = 0603 绿灯: 发光二极管; ComponentLink1Description: 供应商链接; ComponentLink1URL: http://www.szlcsc.com/product/details_73152.html; Package: 0603; Supplier: LC; SuppliersPartNumber: C72043
LS1 = Bell: Electrical Bell; Published: 24-Mar-1999; LatestRevisionDate: 17-Jul-2002; LatestRevisionNote: Re-released for DXP Platform.; PackageReference: PIN2; Publisher: Altium Limited
P1 P7 P23-P26 = CONN HEADER 2POS .100" SNGL TIN: Manufacturer: Samtec Inc; Manufacturer Part Number: TSW-150-08-T-S; Unit Price in Quantity: 1.0189; Part Number: CONN HEADER 2POS .100" SNGL TIN; Mounting Type: thru-hole; Package: header; Component Type: Standard; Pin Count: 2; Supplier 1: Digikey; Supplier 1 Part Number: SAM1050-50-ND; Unit Price-Supplier 1: 2.24; Price Break: 1000; Vendor/Distributor: Digikey
P6 = CONN HEADER PH TOP 2POS 2MM SMD: Manufacturer: JST Sales America Inc.; Unit Price in Quantity: .3467; Part Number: CONN HEADER PH TOP 2POS 2MM SMD; Mounting Type: SMD; Package: header; Component Type: Standard; Pin Count: 2; Manufacturer Part Number: B2B-PH-SM4-TB(LF)(SN); Supplier 1: Digikey; Supplier 1 Part Number: 455-1734-1-ND; Unit Price-Supplier 1: .55; Price Break: 500; Vendor/Distributor: Digikey
P8 P22 = CONN HEADER 3POS .100" SNGL TIN: Manufacturer: Samtec Inc; Manufacturer Part Number: TSW-150-08-T-S; Unit Price in Quantity: 1.0189; Part Number: CONN HEADER 3POS .100" SNGL TIN; Mounting Type: thru-hole; Package: header; Component Type: Standard; Pin Count: 3; Supplier 1: Digikey; Supplier 1 Part Number: SAM1050-50-ND; Unit Price-Supplier 1: 2.24; Price Break: 1000; Vendor/Distributor: Digikey
P9 = CONN HEADER 4POS .100" SNGL TIN: Manufacturer: Samtec Inc; Manufacturer Part Number: TSW-150-08-T-S; Unit Price in Quantity: 1.0189; Part Number: CONN HEADER 4POS .100" SNGL TIN; Mounting Type: thru-hole; Package: header; Component Type: Standard; Pin Count: 4; Supplier 1: Digikey; Supplier 1 Part Number: SAM1050-50-ND; Unit Price-Supplier 1: 2.24; Price Break: 1000; Vendor/Distributor: Digikey
Q1 Q2 = AO3400A N道沟 X0YV1T SOT-23: MOS(场效应管); ComponentLink1Description: 供应商链接; ComponentLink1URL: http://www.szlcsc.com/product/details_21629.html; Package: SOT-23; Supplier: LC; SuppliersPartNumber: C20917
R3 R27-R30 R33-R42 R44 = 0603 10KΩ (1002) 1%: 贴片电阻; ComponentLink1Description: 供应商链接; ComponentLink1URL: http://www.szlcsc.com/product/details_26547.html; Package: 0603; Supplier: LC; SuppliersPartNumber: C25804
R21 R25 R31 = 0603 330Ω (3300) 1%: 贴片电阻; ComponentLink1Description: 供应商链接; ComponentLink1URL: http://www.szlcsc.com/product/details_23865.html; Package: 0603; Supplier: LC; SuppliersPartNumber: C23138
R22 R43 R55 R56 = 0603 0Ω (0R0) 1%: 贴片电阻; ComponentLink1Description: 供应商链接; ComponentLink1URL: http://www.szlcsc.com/product/details_21903.html; Package: 0603; Supplier: LC; SuppliersPartNumber: C21189
R23 = 0603 10MΩ (1005) 1%: 贴片电阻; ComponentLink1Description: 供应商链接; ComponentLink1URL: http://www.szlcsc.com/product/details_7726.html; Package: 0603; Supplier: LC; SuppliersPartNumber: C7250
R24 R26 R32 = 0603 100KΩ (1003) 1%: 贴片电阻; ComponentLink1Description: 供应商链接; ComponentLink1URL: http://www.szlcsc.com/product/details_26546.html; Package: 0603; Supplier: LC; SuppliersPartNumber: C25803
TP1-TP5 = Test Point, 60mil: Designator: TP?; Part Number: Test Point, 60mil; Component Type: Standard (No BOM)
U7 = STM32F4xxZ1: Imported; Vendor: STMicroelectronics; C: Copyright (C) 2016 Accelerated Designs. All rights reserved; Manufacturer_Part_Number: stm32f4xxz1; Copyright: Copyright (C) 2016 Accelerated Designs. All rights reserved; RefDes: RefDes; Type: Type; Value: Value
U8 = M24C02-WMN6TP: IC EEPROM 2KBIT 400KHZ 8SOIC; Manufacturer: STMicroelectronics; Unit Price in Quantity: .2014; Part Number: M24C02-WMN6TP; Component Type: Standard; Pin Count: 8; Manufacturer Part Number: M24C02-WMN6TP; Mounting Type: smt; Package: 8-SOIC; Supplier 1: Digkey; Supplier 1 Part Number: 497-8552-1-ND; Unit Price-Supplier 1: .58; Price Break: 1000; Vendor/Distributor: Digikey
U9 U10 = ltc4307ims8#pbf: Imported; Vendor: Linear Technology; Built_By: EMA_UL_Team; Manufacturer_Part_Number: ltc4307ims8#pbf; RefDes: RefDes; Type: Type; Value: Value
VR1 VR2 = SOT-223 AMS1117-3.3: 低压差线性稳压(LDO); ComponentLink1Description: 供应商链接; ComponentLink1URL: http://www.szlcsc.com/product/details_6652.html; Package: SOT-223; Supplier: LC; SuppliersPartNumber: C6186
Y2 = SMD-5032_2P 8MHz 20ppm 20pF: 贴片晶振; ComponentLink1Description: 供应商链接; ComponentLink1URL: http://www.szlcsc.com/product/details_117214.html; Package: SMD-5032_2P; Supplier: LC; SuppliersPartNumber: C115962

## Sheet IMU.SchDoc
size A2
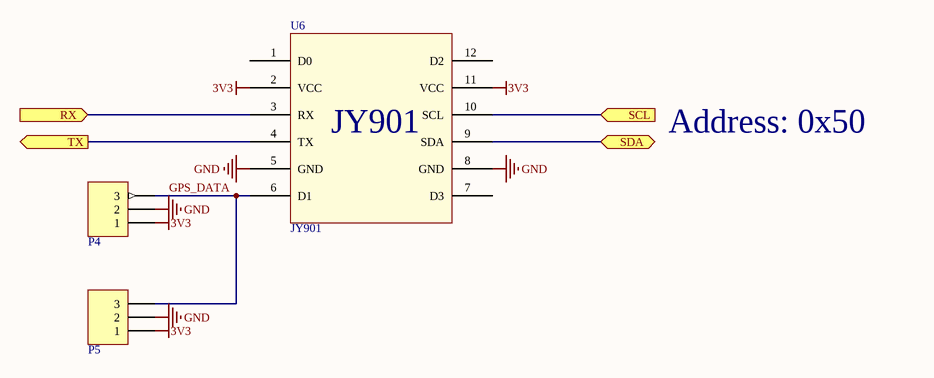
[diagram p4: IMU.SchDoc]

### Parts
P4  0.1" 3POS Header SNGL  [3 POS HEADER SINGLE ROW]  (value not drawn)
P5  B3B-PH-SM4-TB(LF)(SN)  [B3B-PH-SM4-TB(LF)(SN)]  (value not drawn)
U6  JY901  [JY-901]

### Ports
RX (in), SCL (in), SDA (bidir), TX (out)

### Nets
3V3: P4.1 P5.1 U6.2(VCC) U6.11(VCC)
GND: P4.2 P5.2 U6.5(GND) U6.8(GND)
GPS_DATA: P4.3 P5.3 U6.6(D1)
SCL2: U6.10(SCL) ; port SCL
SDA2: U6.9(SDA) ; port SDA
UART8_RX: U6.4(TX) ; port TX
UART8_TX: U6.3(RX) ; port RX

Not connected (* = marked no-connect by the designer): U6 1(D0) 7(D3) 12(D2)

### Notes on the sheet
- Address: 0x50

### Library data of the parts
P4 = CONN HEADER 3POS .100" SNGL TIN: as P8 on sheet STM32&Power; Part Number: CONN HEADER 3POS .100" SNGL TIN; Mounting Type: thru-hole; Package: header; Component Type: Standard; Pin Count: 3; Supplier 1: Digikey; Supplier 1 Part Number: SAM1050-50-ND; Unit Price-Supplier 1: 2.24; Price Break: 1000; Vendor/Distributor: Digikey
P5 = CONN HEADER PH TOP 3POS 2MM SMD: Manufacturer: JST Sales America Inc.; Unit Price in Quantity: .2972; Part Number: CONN HEADER PH TOP 3POS 2MM SMD; Mounting Type: SMD; Package: header; Component Type: Standard; Pin Count: 3; Manufacturer Part Number: B3B-PH-SM4-TB(LF)(SN); Supplier 1: Digikey; Supplier 1 Part Number: 455-1735-1-ND; Unit Price-Supplier 1: .63; Price Break: 1000; Vendor/Distributor: Digikey

## Sheet Humidity&Temperature&Light.SchDoc
size A2
Used 2 times, as channels U1, U2. Parts and nets are listed once, with the designators drawn on the sheet.
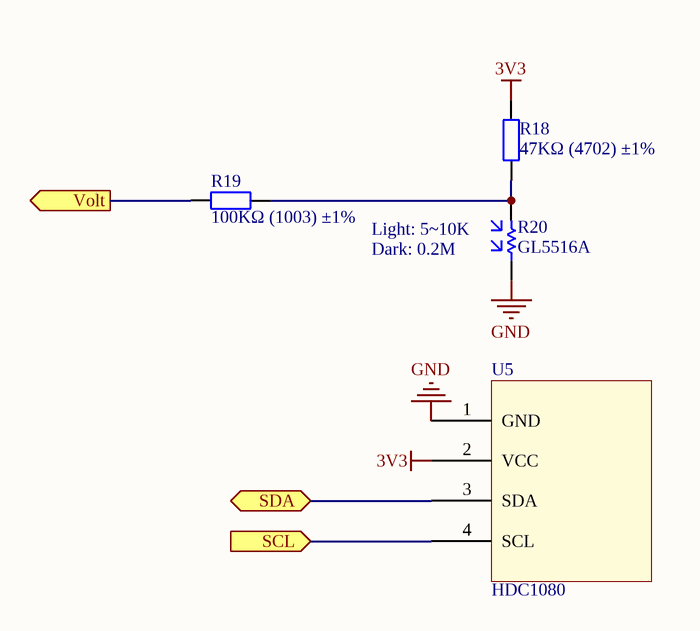
[diagram p5: Humidity&Temperature&Light.SchDoc]

### Parts
R18  47KΩ (4702) ±1%  [0603_R]
R19  100KΩ (1003) ±1%  [0603_R]
R20  GL5516A  [GL5516A]
U5  HDC1080  [HDC1080]

### Ports
SCL (in), SDA (bidir), Volt (out)

### Nets
3V3: R18.2 U5.2(VCC)
GND: R20.1 U5.1(GND)
SCL: U5.4(SCL) ; port SCL
SDA: U5.3(SDA) ; port SDA
Volt: R19.1 ; port Volt
NetR18_1: R18.1 R19.2 R20.2

### Channels
U1: designators end in _U1; ports SCL=SCL2 SDA=SDA2 Volt=NetR19_U1_1
U2: designators end in _U2; ports SCL=SCL1 SDA=SDA1 Volt=NetR19_U2_1

### Notes on the sheet
- (near R20) Light: 5~10K
- (near R20) Dark: 0.2M

### Library data of the parts
R18 = 0603 47KΩ (4702) 1%: 贴片电阻; ComponentLink1Description: 供应商链接; ComponentLink1URL: http://www.szlcsc.com/product/details_26562.html; Package: 0603; Supplier: LC; SuppliersPartNumber: C25819
R19 = 0603 100KΩ (1003) 1%: 贴片电阻; ComponentLink1Description: 供应商链接; ComponentLink1URL: http://www.szlcsc.com/product/details_26546.html; Package: 0603; Supplier: LC; SuppliersPartNumber: C25803

## Sheet CAN.SchDoc
size A2
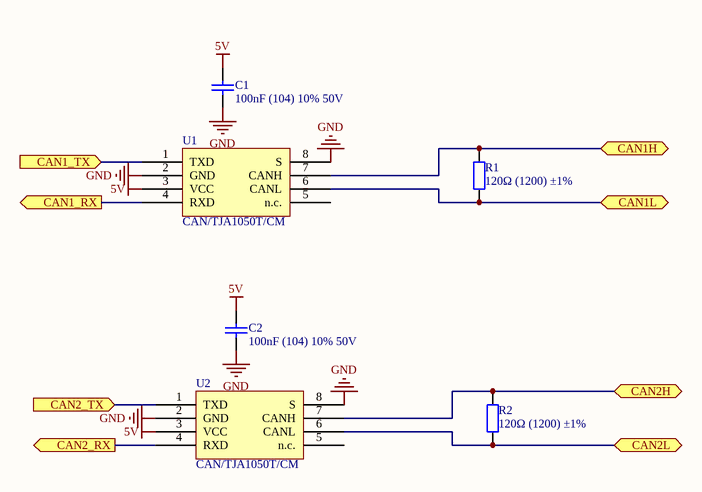
[diagram p6: CAN.SchDoc]

### Parts
C1  100nF (104) 10% 50V  [0603_C]
C2  100nF (104) 10% 50V  [0603_C]
R1  120Ω (1200) ±1%  [0603_R]
R2  120Ω (1200) ±1%  [0603_R]
U1  CAN/TJA1050T/CM  [SOIC-8_150mil]
U2  CAN/TJA1050T/CM  [SOIC-8_150mil]

### Ports
CAN1_RX (out), CAN1_TX (in), CAN1H (bidir), CAN1L (bidir), CAN2_RX (out), CAN2_TX (in), CAN2H (bidir), CAN2L (bidir)

### Nets
5V: C1.2 C2.2 U1.3(VCC) U2.3(VCC)
GND: C1.1 C2.1 U1.2(GND) U1.8(S) U2.2(GND) U2.8(S)
CAN1_N: R1.1 U1.6(CANL) ; port CAN1L
CAN1_P: R1.2 U1.7(CANH) ; port CAN1H
CAN1_RX: U1.4(RXD) ; port CAN1_RX
CAN1_TX: U1.1(TXD) ; port CAN1_TX
CAN2_N: R2.1 U2.6(CANL) ; port CAN2L
CAN2_P: R2.2 U2.7(CANH) ; port CAN2H
CAN2_RX: U2.4(RXD) ; port CAN2_RX
CAN2_TX: U2.1(TXD) ; port CAN2_TX

Not connected (* = marked no-connect by the designer): U1 5(n.c.); U2 5(n.c.)

### Library data of the parts
C1 C2 = 0603 100nF (104) 10% 50V: 贴片电容; ComponentLink1Description: 供应商链接; ComponentLink1URL: http://www.szlcsc.com/product/details_15331.html; Package: 0603; Supplier: LC; SuppliersPartNumber: C14663
R1 R2 = 0603 120Ω (1200) 1%: 贴片电阻; ComponentLink1Description: 供应商链接; ComponentLink1URL: http://www.szlcsc.com/product/details_23514.html; Package: 0603; Supplier: LC; SuppliersPartNumber: C22787
U1 U2 = CAN/TJA1050T/CM_[C6952]: CAN; ComponentLink1Description: 供应商链接; ComponentLink1URL: http://www.szlcsc.com/product/details_7424.html; Package: SOIC-8_150mil; Supplier: LC; SuppliersPartNumber: C6952

## Sheet Ultrasonic.SchDoc
size A2
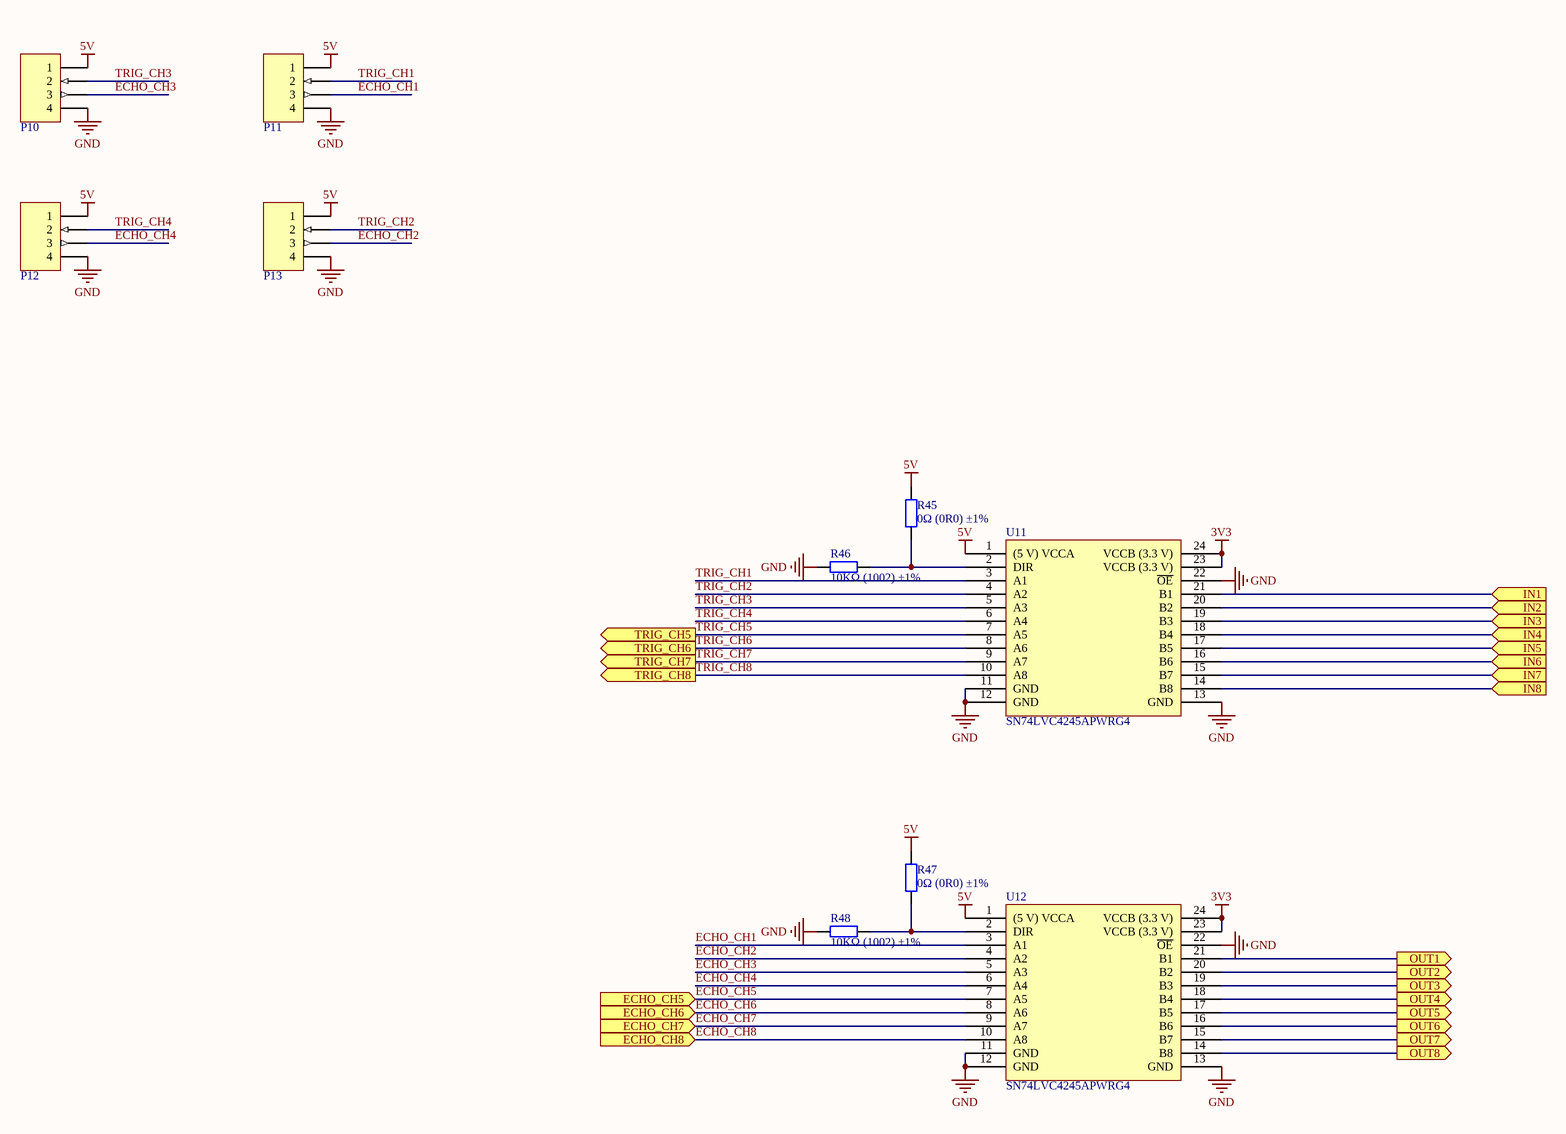
[diagram p7: Ultrasonic.SchDoc]

### Parts
P10  B4B-PH-SM4-TB(LF)(SN)  [B4B-PH-SM4-TB(LF)(SN)]  (value not drawn)
P11  B4B-PH-SM4-TB(LF)(SN)  [B4B-PH-SM4-TB(LF)(SN)]  (value not drawn)
P12  B4B-PH-SM4-TB(LF)(SN)  [B4B-PH-SM4-TB(LF)(SN)]  (value not drawn)
P13  B4B-PH-SM4-TB(LF)(SN)  [B4B-PH-SM4-TB(LF)(SN)]  (value not drawn)
R45  0Ω (0R0) ±1%  [0603_R]
R46  10KΩ (1002) ±1%  [0603_R]
R47  0Ω (0R0) ±1%  [0603_R]
R48  10KΩ (1002) ±1%  [0603_R]
U11  SN74LVC4245APWRG4  [TSSOP-24]
U12  SN74LVC4245APWRG4  [TSSOP-24]

### Ports
ECHO_CH5 (in), ECHO_CH6 (in), ECHO_CH7 (in), ECHO_CH8 (in), IN1 (in), IN2 (in), IN3 (in), IN4 (in), IN5 (in), IN6 (in), IN7 (in), IN8 (in), OUT1 (out), OUT2 (out), OUT3 (out), OUT4 (out), OUT5 (out), OUT6 (out), OUT7 (out), OUT8 (out), TRIG_CH5 (out), TRIG_CH6 (out), TRIG_CH7 (out), TRIG_CH8 (out)

### Nets
3V3: U11.23(VCCB_(3.3_V)) U11.24(VCCB_(3.3_V)) U12.23(VCCB_(3.3_V)) U12.24(VCCB_(3.3_V))
5V: P10.1 P11.1 P12.1 P13.1 R45.2 R47.2 U11.1((5_V)_VCCA) U12.1((5_V)_VCCA)
GND: P10.4 P11.4 P12.4 P13.4 R46.1 R48.1 U11.11(GND) U11.12(GND) U11.13(GND) U11.22(~{OE}) U12.11(GND) U12.12(GND) U12.13(GND) U12.22(~{OE})
ECHO_CH1: P11.3 U12.3(A1)
ECHO_CH2: P13.3 U12.4(A2)
ECHO_CH3: P10.3 U12.5(A3)
ECHO_CH4: P12.3 U12.6(A4)
ECHO_CH5: U12.7(A5) ; port ECHO_CH5
ECHO_CH6: U12.8(A6) ; port ECHO_CH6
ECHO_CH7: U12.9(A7) ; port ECHO_CH7
ECHO_CH8: U12.10(A8) ; port ECHO_CH8
PG0: U11.21(B1) ; port IN1
PG1: U11.20(B2) ; port IN2
PG2: U11.19(B3) ; port IN3
PG3: U11.18(B4) ; port IN4
PG4: U11.17(B5) ; port IN5
PG5: U11.16(B6) ; port IN6
PG6: U11.15(B7) ; port IN7
PG7: U11.14(B8) ; port IN8
PG8: U12.21(B1) ; port OUT1
PG9: U12.20(B2) ; port OUT2
PG10: U12.19(B3) ; port OUT3
PG11: U12.18(B4) ; port OUT4
PG12: U12.17(B5) ; port OUT5
PG13: U12.16(B6) ; port OUT6
PG14: U12.15(B7) ; port OUT7
PG15: U12.14(B8) ; port OUT8
TRIG_CH1: P11.2 U11.3(A1)
TRIG_CH2: P13.2 U11.4(A2)
TRIG_CH3: P10.2 U11.5(A3)
TRIG_CH4: P12.2 U11.6(A4)
TRIG_CH5: U11.7(A5) ; port TRIG_CH5
TRIG_CH6: U11.8(A6) ; port TRIG_CH6
TRIG_CH7: U11.9(A7) ; port TRIG_CH7
TRIG_CH8: U11.10(A8) ; port TRIG_CH8
NetR45_1: R45.1 R46.2 U11.2(DIR)
NetR47_1: R47.1 R48.2 U12.2(DIR)

### Library data of the parts
P10-P13 = CONN HEADER PH TOP 4POS 2MM SMD: Manufacturer: JST Sales America Inc.; Unit Price in Quantity: .3637; Part Number: CONN HEADER PH TOP 4POS 2MM SMD; Mounting Type: SMD; Package: header; Component Type: Standard; Pin Count: 4; Manufacturer Part Number: B4B-PH-SM4-TB(LF)(SN); Supplier 1: Digikey; Supplier 1 Part Number: 455-1736-1-ND; Unit Price-Supplier 1: .8; Price Break: 1000; Vendor/Distributor: Digikey
R45 R47 = 0603 0Ω (0R0) 1%: 贴片电阻; ComponentLink1Description: 供应商链接; ComponentLink1URL: http://www.szlcsc.com/product/details_21903.html; Package: 0603; Supplier: LC; SuppliersPartNumber: C21189
R46 R48 = 0603 10KΩ (1002) 1%: 贴片电阻; ComponentLink1Description: 供应商链接; ComponentLink1URL: http://www.szlcsc.com/product/details_26547.html; Package: 0603; Supplier: LC; SuppliersPartNumber: C25804
U11 U12 = SN74LVC4245APWRG4_[C7859]: 74系列逻辑芯片; ComponentLink1Description: 供应商链接; ComponentLink1URL: http://www.szlcsc.com/product/details_8336.html; Package: TSSOP-24; Supplier: LC; SuppliersPartNumber: C7859

## Sheet Infrared.SchDoc
size A2
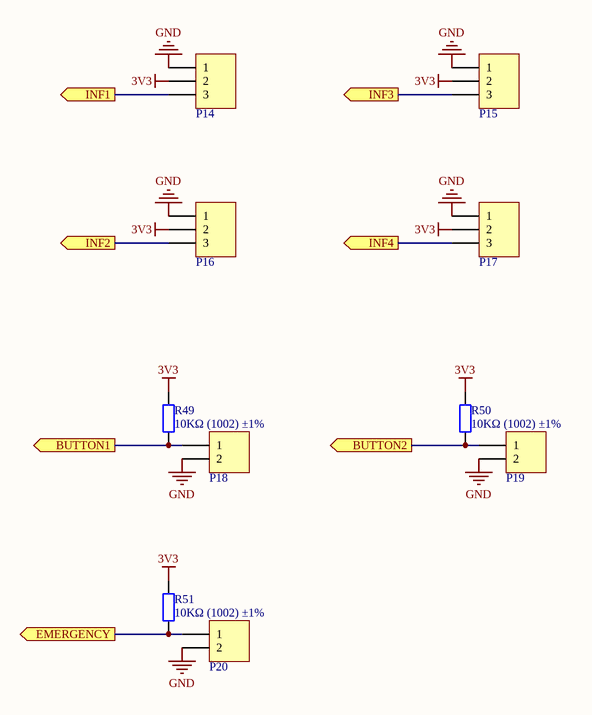
[diagram p8: Infrared.SchDoc]

### Parts
P14  B3B-PH-SM4-TB(LF)(SN)  [B3B-PH-SM4-TB(LF)(SN)]  (value not drawn)
P15  B3B-PH-SM4-TB(LF)(SN)  [B3B-PH-SM4-TB(LF)(SN)]  (value not drawn)
P16  B3B-PH-SM4-TB(LF)(SN)  [B3B-PH-SM4-TB(LF)(SN)]  (value not drawn)
P17  B3B-PH-SM4-TB(LF)(SN)  [B3B-PH-SM4-TB(LF)(SN)]  (value not drawn)
P18  B2B-PH-SM4-TB(LF)(SN)  [B2B-PH-SM4-TB(LF)(SN)]  (value not drawn)
P19  B2B-PH-SM4-TB(LF)(SN)  [B2B-PH-SM4-TB(LF)(SN)]  (value not drawn)
P20  B2B-PH-SM4-TB(LF)(SN)  [B2B-PH-SM4-TB(LF)(SN)]  (value not drawn)
R49  10KΩ (1002) ±1%  [0603_R]
R50  10KΩ (1002) ±1%  [0603_R]
R51  10KΩ (1002) ±1%  [0603_R]

### Ports
BUTTON1 (out), BUTTON2 (out), EMERGENCY (out), INF1 (out), INF2 (out), INF3 (out), INF4 (out)

### Nets
3V3: P14.2 P15.2 P16.2 P17.2 R49.2 R50.2 R51.2
GND: P14.1 P15.1 P16.1 P17.1 P18.2 P19.2 P20.2
BUTTON1: P18.1 R49.1 ; port BUTTON1
BUTTON2: P19.1 R50.1 ; port BUTTON2
EMERGENCY: P20.1 R51.1 ; port EMERGENCY
INF1: P14.3 ; port INF1
INF2: P16.3 ; port INF2
INF3: P15.3 ; port INF3
INF4: P17.3 ; port INF4

### Library data of the parts
P14-P17 = CONN HEADER PH TOP 3POS 2MM SMD: as P5 on sheet IMU; Part Number: CONN HEADER PH TOP 3POS 2MM SMD; Mounting Type: SMD; Package: header; Component Type: Standard; Pin Count: 3; Manufacturer Part Number: B3B-PH-SM4-TB(LF)(SN); Supplier 1: Digikey; Supplier 1 Part Number: 455-1735-1-ND; Unit Price-Supplier 1: .63; Price Break: 1000; Vendor/Distributor: Digikey
P18-P20 = CONN HEADER PH TOP 2POS 2MM SMD: as P6 on sheet STM32&Power; Part Number: CONN HEADER PH TOP 2POS 2MM SMD; Mounting Type: SMD; Package: header; Component Type: Standard; Pin Count: 2; Manufacturer Part Number: B2B-PH-SM4-TB(LF)(SN); Supplier 1: Digikey; Supplier 1 Part Number: 455-1734-1-ND; Unit Price-Supplier 1: .55; Price Break: 500; Vendor/Distributor: Digikey
R49-R51 = 0603 10KΩ (1002) 1%: 贴片电阻; ComponentLink1Description: 供应商链接; ComponentLink1URL: http://www.szlcsc.com/product/details_26547.html; Package: 0603; Supplier: LC; SuppliersPartNumber: C25804

## Sheet Interface.SchDoc
size A2
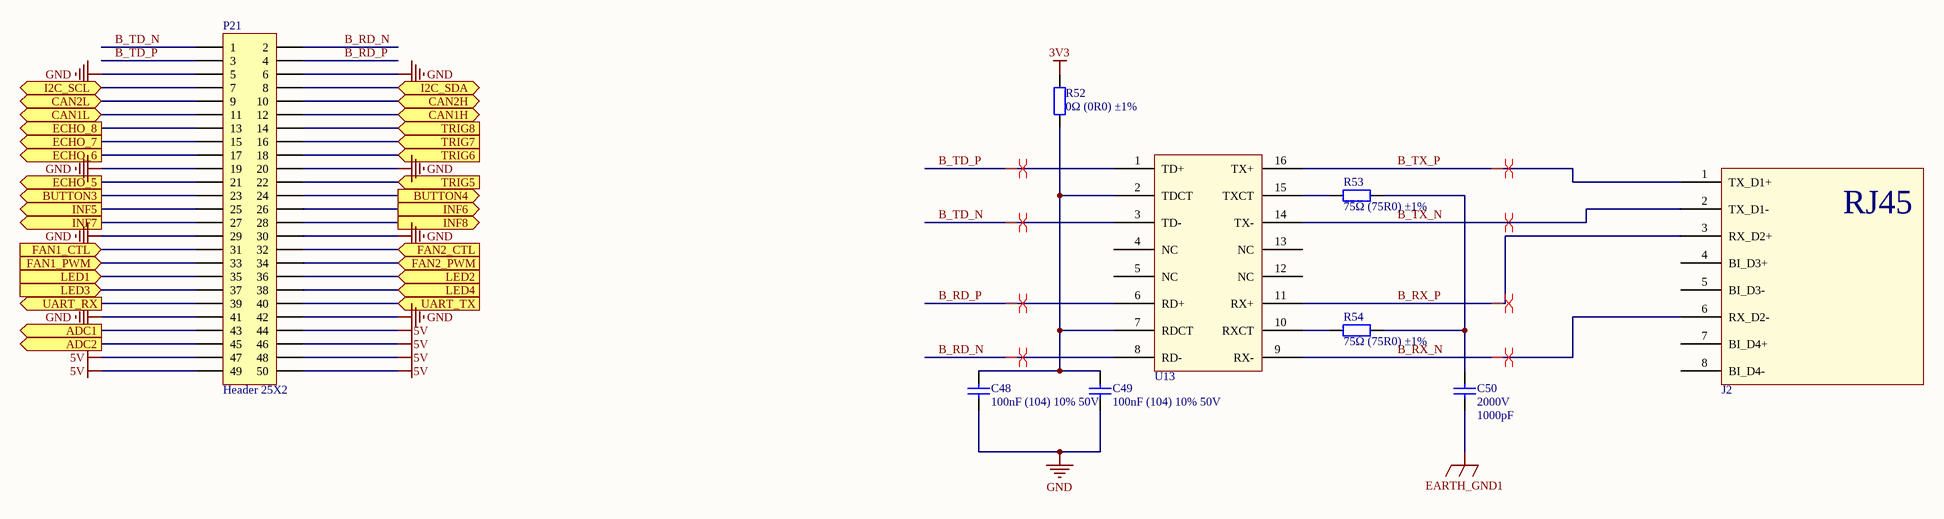
[diagram p9: Interface.SchDoc]

### Parts
C48  100nF (104) 10% 50V  [0603_C]
C49  100nF (104) 10% 50V  [0603_C]
C50  2000V  value 1000pF  [CAP1210N]
J2  Jack Modular Connector 8p8c (RJ45, Ethernet) Vertical Unshielded Cat3  [RJ45-5556416-1]  (value not drawn)
P21  Header 25X2  [HDR_2X25]
R52  0Ω (0R0) ±1%  [0603_R]
R53  75Ω (75R0) ±1%  [0603_R]
R54  75Ω (75R0) ±1%  [0603_R]
U13  TRANSFORMER  [Bel_transformer]  (value not drawn)

### Ports
ADC1 (out), ADC2 (out), BUTTON3 (out), BUTTON4 (out), CAN1H (bidir), CAN1L (bidir), CAN2H (bidir), CAN2L (bidir), ECHO_5 (out), ECHO_6 (out), ECHO_7 (out), ECHO_8 (out), FAN1_CTL (in), FAN1_PWM (in), FAN2_CTL (in), FAN2_PWM (in), I2C_SCL (bidir), I2C_SDA (bidir), INF5 (out), INF6 (out), INF7 (out), INF8 (out), LED1 (in), LED2 (in), LED3 (in), LED4 (in), TRIG5 (in), TRIG6 (in), TRIG7 (in), TRIG8 (in), UART_RX (out), UART_TX (in)

### Nets
3V3: R52.2
5V: P21.44 P21.46 P21.47 P21.48 P21.49 P21.50
EARTH_GND1: C50.1
GND: C48.2 C49.1 P21.5 P21.6 P21.19 P21.20 P21.29 P21.30 P21.41 P21.42
ADC1: P21.43 ; port ADC1
ADC2: P21.45 ; port ADC2
B_RD_N: P21.2 U13.8(RD-)
B_RD_P: P21.4 U13.6(RD+)
B_RX_N: J2.6(RX_D2-) U13.9(RX-)
B_RX_P: J2.3(RX_D2+) U13.11(RX+)
B_TD_N: P21.1 U13.3(TD-)
B_TD_P: P21.3 U13.1(TD+)
B_TX_N: J2.2(TX_D1-) U13.14(TX-)
B_TX_P: J2.1(TX_D1+) U13.16(TX+)
BUTTON3: P21.23 ; port BUTTON3
BUTTON4: P21.24 ; port BUTTON4
CAN1_N: P21.11 ; port CAN1L
CAN1_P: P21.12 ; port CAN1H
CAN2_N: P21.9 ; port CAN2L
CAN2_P: P21.10 ; port CAN2H
ECHO_CH5: P21.21 ; port ECHO_5
ECHO_CH6: P21.17 ; port ECHO_6
ECHO_CH7: P21.15 ; port ECHO_7
ECHO_CH8: P21.13 ; port ECHO_8
FAN1_CTL: P21.31 ; port FAN1_CTL
FAN1_PWM: P21.33 ; port FAN1_PWM
FAN2_CTL: P21.32 ; port FAN2_CTL
FAN2_PWM: P21.34 ; port FAN2_PWM
INF5: P21.25 ; port INF5
INF6: P21.26 ; port INF6
INF7: P21.27 ; port INF7
INF8: P21.28 ; port INF8
LED1: P21.35 ; port LED1
LED2: P21.36 ; port LED2
LED3: P21.37 ; port LED3
LED4: P21.38 ; port LED4
SCL1: P21.7 ; port I2C_SCL
SDA1: P21.8 ; port I2C_SDA
TRIG_CH5: P21.22 ; port TRIG5
TRIG_CH6: P21.18 ; port TRIG6
TRIG_CH7: P21.16 ; port TRIG7
TRIG_CH8: P21.14 ; port TRIG8
USART3_RX: P21.39 ; port UART_RX
USART3_TX: P21.40 ; port UART_TX
NetC48_1: C48.1 C49.2 R52.1 U13.2(TDCT) U13.7(RDCT)
NetC50_2: C50.2 R53.2 R54.2
NetR53_1: R53.1 U13.15(TXCT)
NetR54_1: R54.1 U13.10(RXCT)

Not connected (* = marked no-connect by the designer): J2 4(BI_D3+) 5(BI_D3-) 7(BI_D4+) 8(BI_D4-); U13 4(NC) 5(NC) 12(NC) 13(NC)

### Layout directives
differential pair: B_RD_N, B_RD_P, B_RX_N, B_RX_P, B_TD_N, B_TD_P, B_TX_N, B_TX_P

### Notes on the sheet
- (in symbol 5556416-1) RJ45

### Library data of the parts
C48 C49 = 0603 100nF (104) 10% 50V: 贴片电容; ComponentLink1Description: 供应商链接; ComponentLink1URL: http://www.szlcsc.com/product/details_15331.html; Package: 0603; Supplier: LC; SuppliersPartNumber: C14663
C50 = CAP 1000pF ±10% 2000V (2kV) Ceramic Capacitor X7R 1210 (3225 Metric): as C14 on sheet Ethernet; Part Number: CAP 1000pF ±10% 2000V (2kV) Ceramic Capacitor X7R 1210 (3225 Metric); Component Type: Standard; Mounting Type: smt; Supplier 1: Digikey; Supplier 1 Part Number: 1276-3316-6-ND; Part URL-Supplier 1: https://www.digikey.com/product-detail/en/samsung-electro-mechanics/CL32B102KJFNNNE/1276-3316-6-ND/3893831; Unit Price-Supplier 1: 0.34; Price Break: 1000; Vendor/Distributor: Digikey; Package: 1210
J2 = 5556416-1: as J1 on sheet Ethernet; Part Number: 5556416-1; Mounting Type: thru-hole; Package: Header; Component Type: Standard; Pin Count: 8; Manufacturer Part Number: 5556416-1; Supplier 1: Digikey; Supplier 1 Part Number: A31428-ND; Unit Price-Supplier 1: 1.04; Price Break: 1000; Vendor/Distributor: Digikey
P21 = Header 25X2: Header, 25-Pin, Dual row; LatestRevisionDate: 17-Jul-2002; LatestRevisionNote: Re-released for DXP Platform.; Publisher: Altium Limited
R52 = 0603 0Ω (0R0) 1%: 贴片电阻; ComponentLink1Description: 供应商链接; ComponentLink1URL: http://www.szlcsc.com/product/details_21903.html; Package: 0603; Supplier: LC; SuppliersPartNumber: C21189
R53 R54 = 0603 75Ω (75R0) 1%: 贴片电阻; ComponentLink1Description: 供应商链接; ComponentLink1URL: http://www.szlcsc.com/product/details_4682.html; Package: 0603; Supplier: LC; SuppliersPartNumber: C4275
U13 = MODULE XFRMR LAN 10/100B-TX SMD: as U4 on sheet Ethernet; Part Number: MODULE XFRMR LAN 10/100B-TX SMD; Mounting Type: smt; Package: Non-standard; Component Type: Standard; DatasheetDocument: https://www.belfuse.com/resources/ICMs/lan-/S558-5999-U7-F.pdf; Supplier 1: Digikey; Supplier 1 Part Number: 507-1463-1-ND; Part URL-Supplier 1: https://www.digikey.sg/product-detail/zh/bel-fuse-inc/S558-5999-U7-F/507-1463-1-ND/2108047; Unit Price-Supplier 1: 3.6; Price Break: 900; Vendor/Distributor: Digikey

## Nets that join several sheets
3V3: Ethernet (19 pins), STM32&Power (60 pins), IMU (P4.1 P5.1 U6.2 U6.11), U1 (R18_U1.2 U5_U1.2), U2 (R18_U2.2 U5_U2.2), Ultrasonic (U11.23 U11.24 U12.23 U12.24), Infrared (7 pins), Interface (R52.2)
5V: STM32&Power (8 pins), CAN (C1.2 C2.2 U1.3 U2.3), Ultrasonic (8 pins), Interface (6 pins)
GND: Ethernet (19 pins), STM32&Power (66 pins), IMU (P4.2 P5.2 U6.5 U6.8), U1 (R20_U1.1 U5_U1.1), U2 (R20_U2.1 U5_U2.1), CAN (6 pins), Ultrasonic (14 pins), Infrared (7 pins), Interface (10 pins)
ADC1: STM32&Power (U7.15), Interface (P21.43)
ADC2: STM32&Power (U7.18), Interface (P21.45)
BUTTON1: STM32&Power (U7.58), Infrared (P18.1 R49.1)
BUTTON2: STM32&Power (U7.50), Infrared (P19.1 R50.1)
BUTTON3: STM32&Power (U7.60), Interface (P21.23)
BUTTON4: STM32&Power (U7.63), Interface (P21.24)
CAN1_N: CAN (R1.1 U1.6), Interface (P21.11)
CAN1_P: CAN (R1.2 U1.7), Interface (P21.12)
CAN1_RX: STM32&Power (U7.103), CAN (U1.4)
CAN1_TX: STM32&Power (U7.104), CAN (U1.1)
CAN2_N: CAN (R2.1 U2.6), Interface (P21.9)
CAN2_P: CAN (R2.2 U2.7), Interface (P21.10)
CAN2_RX: STM32&Power (U7.135), CAN (U2.4)
CAN2_TX: STM32&Power (U7.136), CAN (U2.1)
CRS  _DV: Ethernet (R9.1 U3.40), STM32&Power (U7.43)
ECHO_CH5: Ultrasonic (U12.7), Interface (P21.21)
ECHO_CH6: Ultrasonic (U12.8), Interface (P21.17)
ECHO_CH7: Ultrasonic (U12.9), Interface (P21.15)
ECHO_CH8: Ultrasonic (U12.10), Interface (P21.13)
EMERGENCY: STM32&Power (U7.54), Infrared (P20.1 R51.1)
FAN1_CTL: STM32&Power (U7.68), Interface (P21.31)
FAN1_PWM: STM32&Power (U7.75), Interface (P21.33)
FAN2_CTL: STM32&Power (U7.69), Interface (P21.32)
FAN2_PWM: STM32&Power (U7.76), Interface (P21.34)
INF1: STM32&Power (U7.55), Infrared (P14.3)
INF2: STM32&Power (U7.59), Infrared (P16.3)
INF3: STM32&Power (U7.53), Infrared (P15.3)
INF4: STM32&Power (U7.49), Infrared (P17.3)
INF5: STM32&Power (U7.64), Interface (P21.25)
INF6: STM32&Power (U7.65), Interface (P21.26)
INF7: STM32&Power (U7.66), Interface (P21.27)
INF8: STM32&Power (U7.67), Interface (P21.28)
LED1: STM32&Power (U7.99), Interface (P21.35)
LED2: STM32&Power (U7.98), Interface (P21.36)
LED3: STM32&Power (U7.97), Interface (P21.37)
LED4: STM32&Power (U7.96), Interface (P21.38)
MDC: Ethernet (U3.31), STM32&Power (U7.27)
MDIO: Ethernet (U3.30), STM32&Power (U7.36)
NetR19_U1_1: STM32&Power (U7.14), U1 (R19_U1.1)
NetR19_U2_1: STM32&Power (U7.13), U2 (R19_U2.1)
NRST: Ethernet (U3.29), STM32&Power (5 pins)
PG0: STM32&Power (U7.56), Ultrasonic (U11.21)
PG1: STM32&Power (U7.57), Ultrasonic (U11.20)
PG2: STM32&Power (U7.87), Ultrasonic (U11.19)
PG3: STM32&Power (U7.88), Ultrasonic (U11.18)
PG4: STM32&Power (U7.89), Ultrasonic (U11.17)
PG5: STM32&Power (U7.90), Ultrasonic (U11.16)
PG6: STM32&Power (U7.91), Ultrasonic (U11.15)
PG7: STM32&Power (U7.92), Ultrasonic (U11.14)
PG8: STM32&Power (U7.93), Ultrasonic (U12.21)
PG9: STM32&Power (U7.124), Ultrasonic (U12.20)
PG10: STM32&Power (U7.125), Ultrasonic (U12.19)
PG11: STM32&Power (U7.126), Ultrasonic (U12.18)
PG12: STM32&Power (U7.127), Ultrasonic (U12.17)
PG13: STM32&Power (U7.128), Ultrasonic (U12.16)
PG14: STM32&Power (U7.129), Ultrasonic (U12.15)
PG15: STM32&Power (U7.132), Ultrasonic (U12.14)
REF_CLK: Ethernet (U3.34 Y1.3), STM32&Power (U7.35)
RXD0: Ethernet (U3.43), STM32&Power (U7.44)
RXD1: Ethernet (U3.44), STM32&Power (U7.45)
SCL1: STM32&Power (5 pins), U2 (U5_U2.4), Interface (P21.7)
SCL2: STM32&Power (P23.1 R34.1 U9.2), IMU (U6.10), U1 (U5_U1.4)
SDA1: STM32&Power (5 pins), U2 (U5_U2.3), Interface (P21.8)
SDA2: STM32&Power (P24.1 R33.1 U9.7), IMU (U6.9), U1 (U5_U1.3)
TRIG_CH5: Ultrasonic (U11.7), Interface (P21.22)
TRIG_CH6: Ultrasonic (U11.8), Interface (P21.18)
TRIG_CH7: Ultrasonic (U11.9), Interface (P21.16)
TRIG_CH8: Ultrasonic (U11.10), Interface (P21.14)
TX_EN: Ethernet (U3.2), STM32&Power (U7.70)
TXD0: Ethernet (U3.3), STM32&Power (U7.73)
TXD1: Ethernet (U3.4), STM32&Power (U7.74)
UART8_RX: STM32&Power (P22.2 U7.141), IMU (U6.4)
UART8_TX: STM32&Power (P22.3 U7.142), IMU (U6.3)
USART3_RX: STM32&Power (U7.112), Interface (P21.39)
USART3_TX: STM32&Power (U7.111), Interface (P21.40)

## Assembly variants
Default: not fitted P1 P4 P10 P11 P20 P23 P24 P25 P26 R29 R43 R44 R45